# EAGLE design elm6 (EAGLE 4.16)

## Sheet 1 of 4
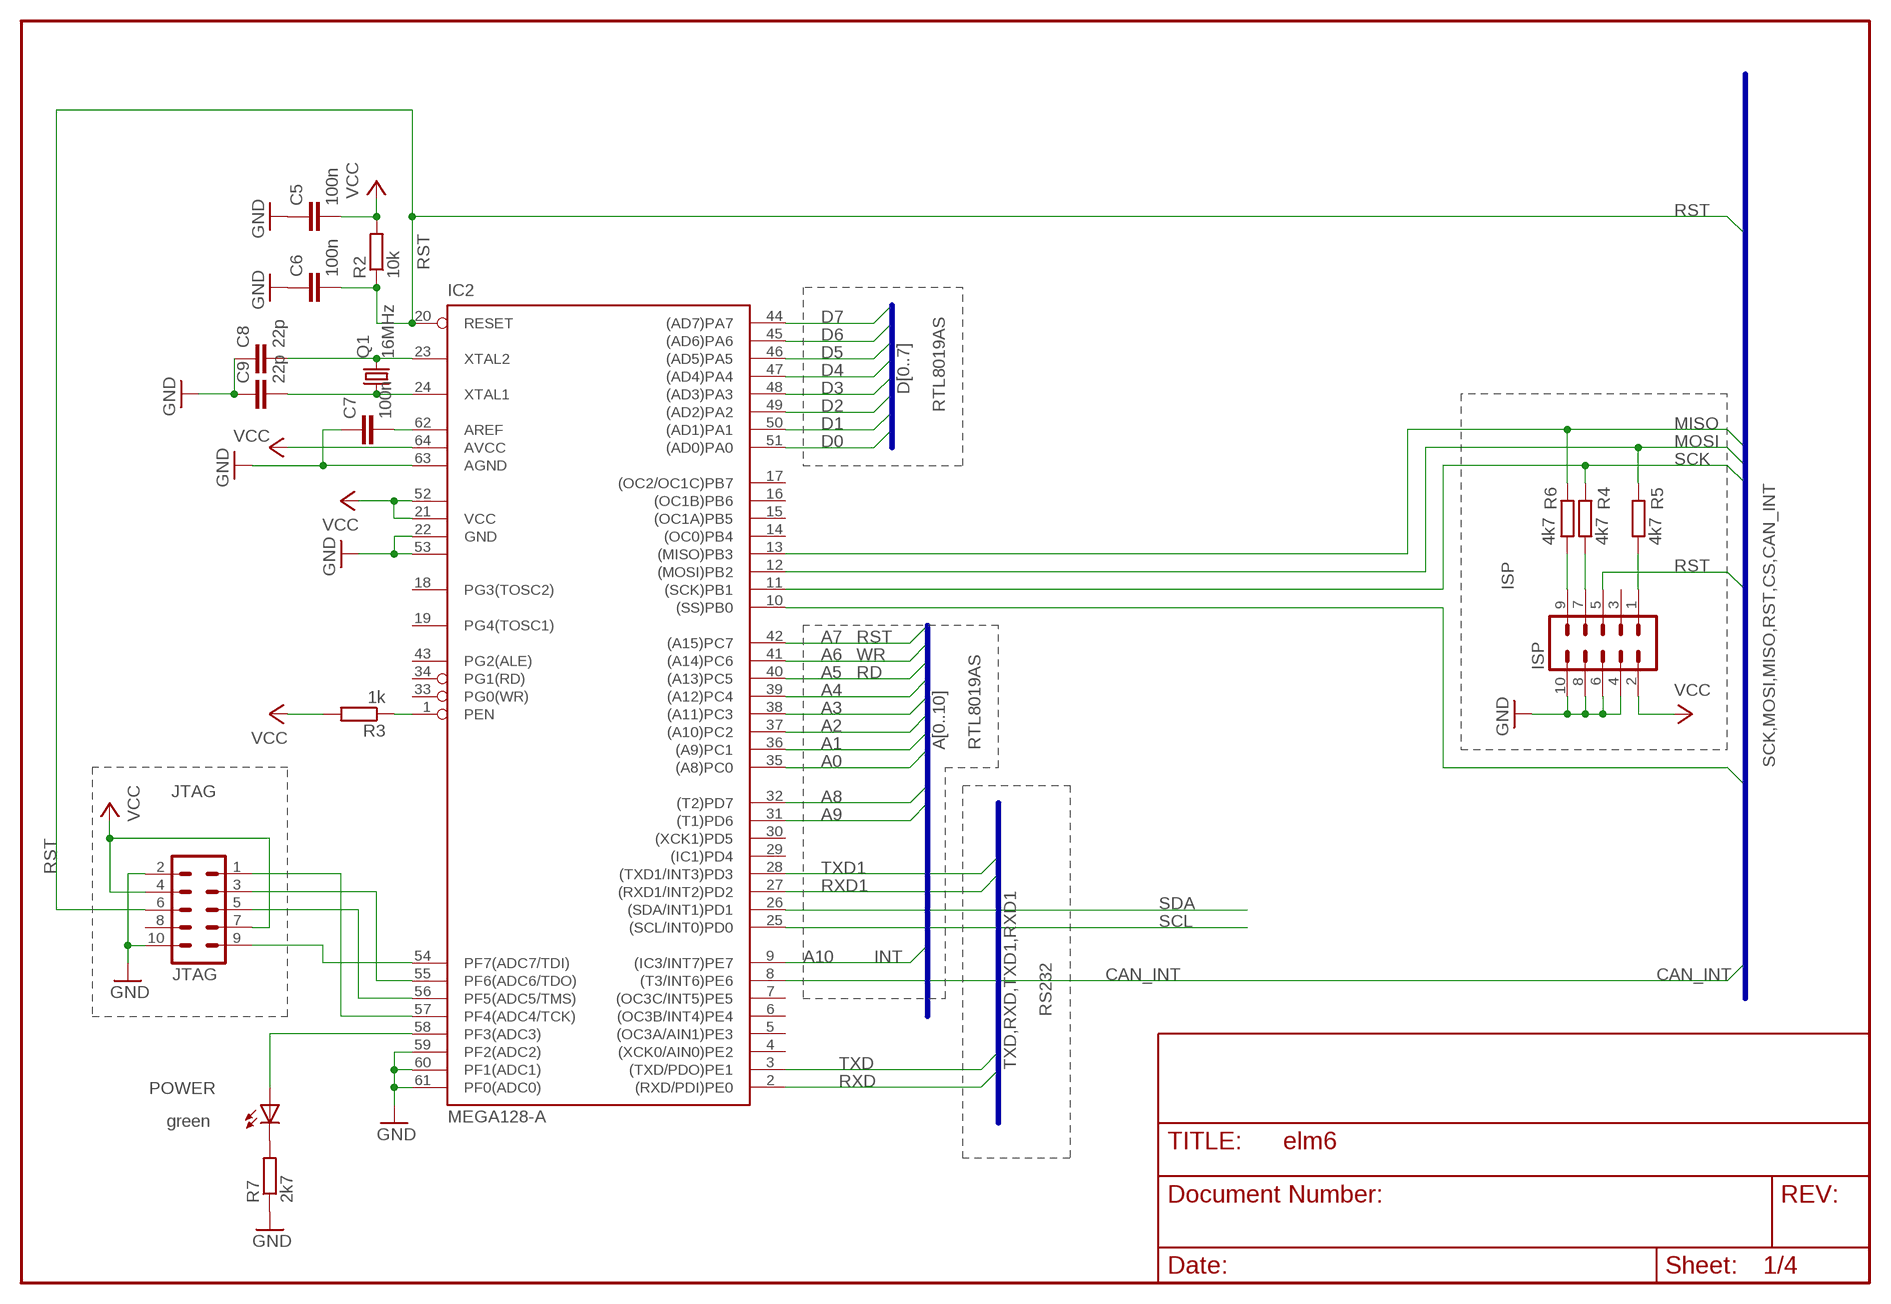
[diagram p0: schematic, sheet 1]

### Parts
C5  100n  C-EUC0603  [C0603]
C6  100n  C-EUC0603  [C0603]
C7  100n  C-EUC0603  [C0603]
C8  22p  C-EUC0603  [C0603]
C9  22p  C-EUC0603  [C0603]
IC2  MEGA128-A  [TQFP64]
ISP  MA05-2  [MA05-2]
JTAG  MA05-2  [MA05-2]
POWER  green  LED3MM  [LED3MM]
Q1  16MHz  CRYSTALHC49U-V  [HC49U-V]
R2  10k  R-EU_R0805  [R0805]
R3  1k  R-EU_R0805  [R0805]
R4  4k7  R-EU_R0805  [R0805]
R5  4k7  R-EU_R0805  [R0805]
R6  4k7  R-EU_R0805  [R0805]
R7  2k7  R-EU_R0805  [R0805]

### Nets
A0: IC2.35((A8)PC0) ; also sheet 3
A1: IC2.36((A9)PC1) ; also sheet 3
A2: IC2.37((A10)PC2) ; also sheet 3
A3: IC2.38((A11)PC3) ; also sheet 3
A4: IC2.39((A12)PC4) ; also sheet 3
A5: IC2.40((A13)PC5) ; also sheet 3
A6: IC2.41((A14)PC6) ; also sheet 3
A7: IC2.42((A15)PC7) ; also sheet 3
A8: IC2.32((T2)PD7) ; also sheet 3
A9: IC2.31((T1)PD6) ; also sheet 3
A10: IC2.9((IC3/INT7)PE7) ; also sheet 3
CAN_INT: IC2.8((T3/INT6)PE6) ; also sheet 2
CS: IC2.10((SS)PB0) ; also sheet 2
D0: IC2.51((AD0)PA0) ; also sheet 3
D1: IC2.50((AD1)PA1) ; also sheet 3
D2: IC2.49((AD2)PA2) ; also sheet 3
D3: IC2.48((AD3)PA3) ; also sheet 3
D4: IC2.47((AD4)PA4) ; also sheet 3
D5: IC2.46((AD5)PA5) ; also sheet 3
D6: IC2.45((AD6)PA6) ; also sheet 3
D7: IC2.44((AD7)PA7) ; also sheet 3
GND: C5.1 C6.1 C7.1 C8.1 C9.1 IC2.22(GND) IC2.53(GND1) IC2.59(PF2(ADC2)) IC2.60(PF1(ADC1)) IC2.61(PF0(ADC0)) IC2.63(AGND) ISP.4 ISP.6 ISP.8 ISP.10 JTAG.2 JTAG.10 R7.1 ; also sheet 2,3,4
MISO: IC2.13((MISO)PB3) R6.2 ; also sheet 2
MOSI: IC2.12((MOSI)PB2) R5.2 ; also sheet 2
N$5: C7.2 IC2.62(AREF)
N$6: C9.2 IC2.24(XTAL1) Q1.1
N$7: C8.2 IC2.23(XTAL2) Q1.2
N$22: ISP.9 R6.1
N$25: ISP.1 R5.1
N$26: IC2.1(PEN) R3.1
N$29: ISP.7 R4.1
N$31: POWER.K(C) R7.2
N$32: IC2.58(PF3(ADC3)) POWER.A
N$68: IC2.54(PF7(ADC7/TDI)) JTAG.9
N$69: IC2.55(PF6(ADC6/TDO)) JTAG.3
N$70: IC2.56(PF5(ADC5/TMS)) JTAG.5
N$71: IC2.57(PF4(ADC4/TCK)) JTAG.1
RST: C6.2 IC2.20(RESET) ISP.5 JTAG.6 R2.1 ; also sheet 2,4
RXD: IC2.2((RXD/PDI)PE0) ; also sheet 4
RXD1: IC2.27((RXD1/INT2)PD2) ; also sheet 4
SCK: IC2.11((SCK)PB1) R4.2 ; also sheet 2
SCL: IC2.25((SCL/INT0)PD0) ; also sheet 4
SDA: IC2.26((SDA/INT1)PD1) ; also sheet 4
TXD: IC2.3((TXD/PDO)PE1) ; also sheet 4
TXD1: IC2.28((TXD1/INT3)PD3) ; also sheet 4
VCC: C5.2 IC2.21(VCC) IC2.52(VCC1) IC2.64(AVCC) ISP.2 JTAG.4 JTAG.7 R2.2 R3.2 ; also sheet 2,3,4
Unconnected: IC2.4((XCK0/AIN0)PE2) IC2.5((OC3A/AIN1)PE3) IC2.6((OC3B/INT4)PE4) IC2.7((OC3C/INT5)PE5) IC2.14((OC0)PB4) IC2.15((OC1A)PB5) IC2.16((OC1B)PB6) IC2.17((OC2/OC1C)PB7) IC2.18(PG3(TOSC2)) IC2.19(PG4(TOSC1)) IC2.29((IC1)PD4) IC2.30((XCK1)PD5) IC2.33(PG0(WR)) IC2.34(PG1(RD)) IC2.43(PG2(ALE)) ISP.3 JTAG.8

### Buses
SCK,MOSI,MISO,RST,CS,CAN_INT
TXD,RXD,TXD1,RXD1
D[0..7]
A[0..10]

### Notes on the sheet
- RTL8019AS
- ISP
- RST
- WR
- RD
- RTL8019AS
- JTAG
- INT
- RS232

## Sheet 2 of 4
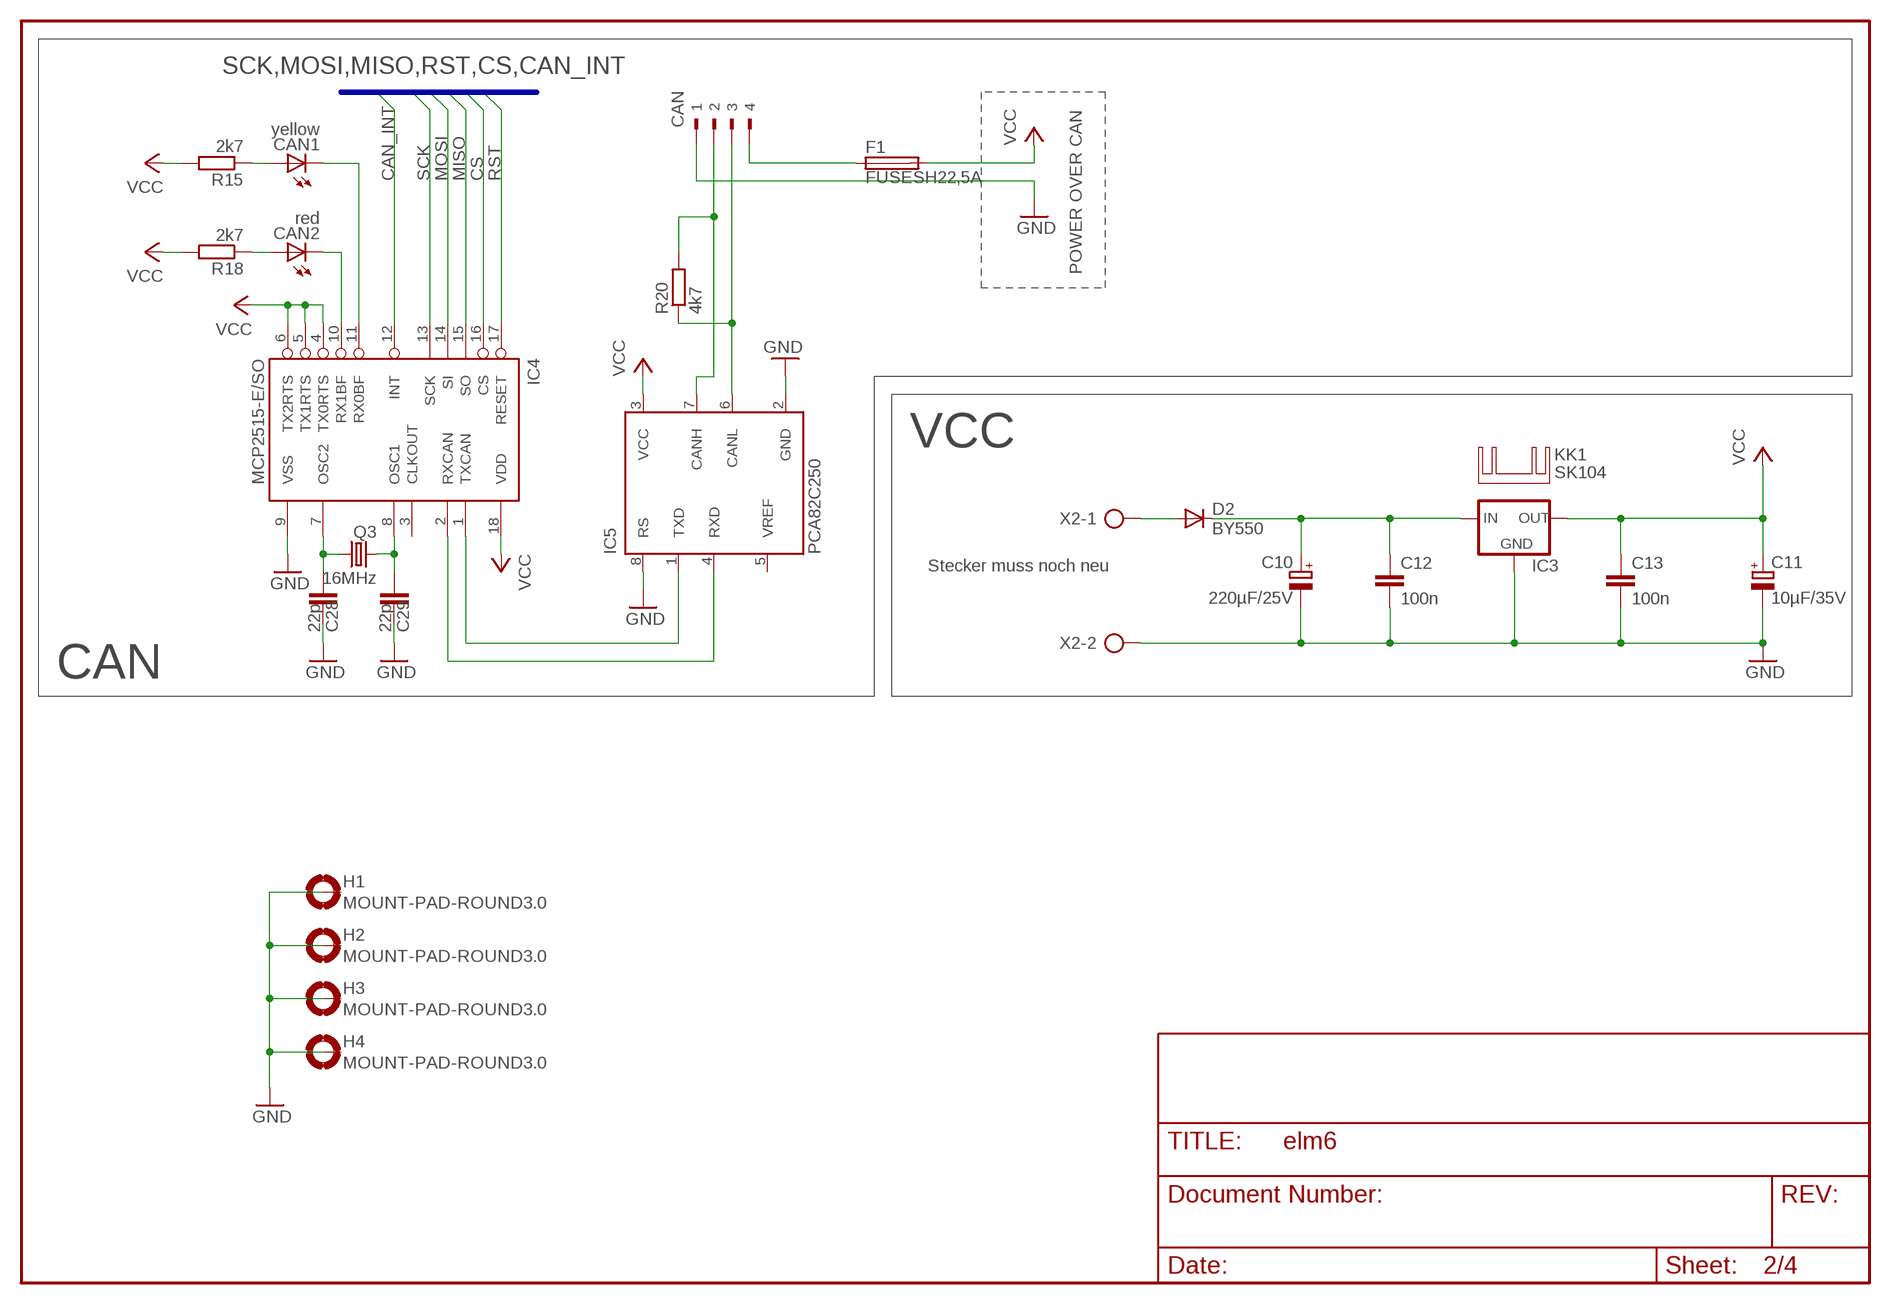
[diagram p1: schematic, sheet 2]

### Parts
C10  220µF/25V  CPOL-EUE3.5-8  [E3,5-8]
C11  10µF/35V  CPOL-EUE2-5  [E2-5]
C12  100n  C-EUC0603  [C0603]
C13  100n  C-EUC0603  [C0603]
C28  22p  C-EUC0603  [C0603]
C29  22p  C-EUC0603  [C0603]
CAN  90-4  [90-4]
CAN1  yellow  LED3MM  [LED3MM]
CAN2  red  LED3MM  [LED3MM]
D2  BY550  [DO27-15]
F1  FUSESH22,5A  [SH22,5A]
H1  MOUNT-PAD-ROUND3.0  [3,0-PAD]
H2  MOUNT-PAD-ROUND3.0  [3,0-PAD]
H3  MOUNT-PAD-ROUND3.0  [3,0-PAD]
H4  MOUNT-PAD-ROUND3.0  [3,0-PAD]
IC3  78XXS  [78XXS]
IC4  MCP2515-E/SO  [SO18L]
IC5  PCA82C250  [DIL08]
KK1  SK104  [SK104]
Q3  16MHz  CRYSTALHC49U-V  [HC49U-V]
R15  2k7  R-EU_R0805  [R0805]
R18  2k7  R-EU_R0805  [R0805]
R20  4k7  R-EU_R0805  [R0805]
X2  AK500/2-H  [AK500/2-H]

### Nets
CAN_INT: IC4.12(INT) ; also sheet 1
CS: IC4.16(CS) ; also sheet 1
GND: C10.- C11.- C12.2 C13.2 C28.2 C29.2 CAN.1 H1.B3,0(MOUNT) H2.B3,0(MOUNT) H3.B3,0(MOUNT) H4.B3,0(MOUNT) IC3.GND IC4.9(VSS) IC5.2(GND) IC5.8(RS) X2.2 ; also sheet 1,3,4
MISO: IC4.15(SO) ; also sheet 1
MOSI: IC4.14(SI) ; also sheet 1
N$2: IC4.1(TXCAN) IC5.1(TXD)
N$8: C10.+ C12.1 D2.C IC3.IN
N$10: D2.A X2.1
N$16: CAN.4 F1.1
N$21: IC4.2(RXCAN) IC5.4(RXD)
N$23: CAN.3 IC5.6(CANL) R20.1
N$27: CAN1.K(C) IC4.11(RX0BF)
N$38: CAN2.K(C) IC4.10(RX1BF)
N$48: CAN1.A R15.1
N$52: CAN2.A R18.1
N$53: C28.1 IC4.7(OSC2) Q3.1
N$54: C29.1 IC4.8(OSC1) Q3.2
N$59: CAN.2 IC5.7(CANH) R20.2
RST: IC4.17(RESET) ; also sheet 1,4
SCK: IC4.13(SCK) ; also sheet 1
VCC: C11.+ C13.1 F1.2 IC3.OUT IC4.4(TX0RTS) IC4.5(TX1RTS) IC4.6(TX2RTS) IC4.18(VDD) IC5.3(VCC) R15.2 R18.2 ; also sheet 1,3,4
Unconnected: IC4.3(CLKOUT) IC5.5(VREF)

### Buses
SCK,MOSI,MISO,RST,CS,CAN_INT

### Notes on the sheet
- POWER OVER CAN
- VCC
- Stecker muss noch neu
- CAN

## Sheet 3 of 4
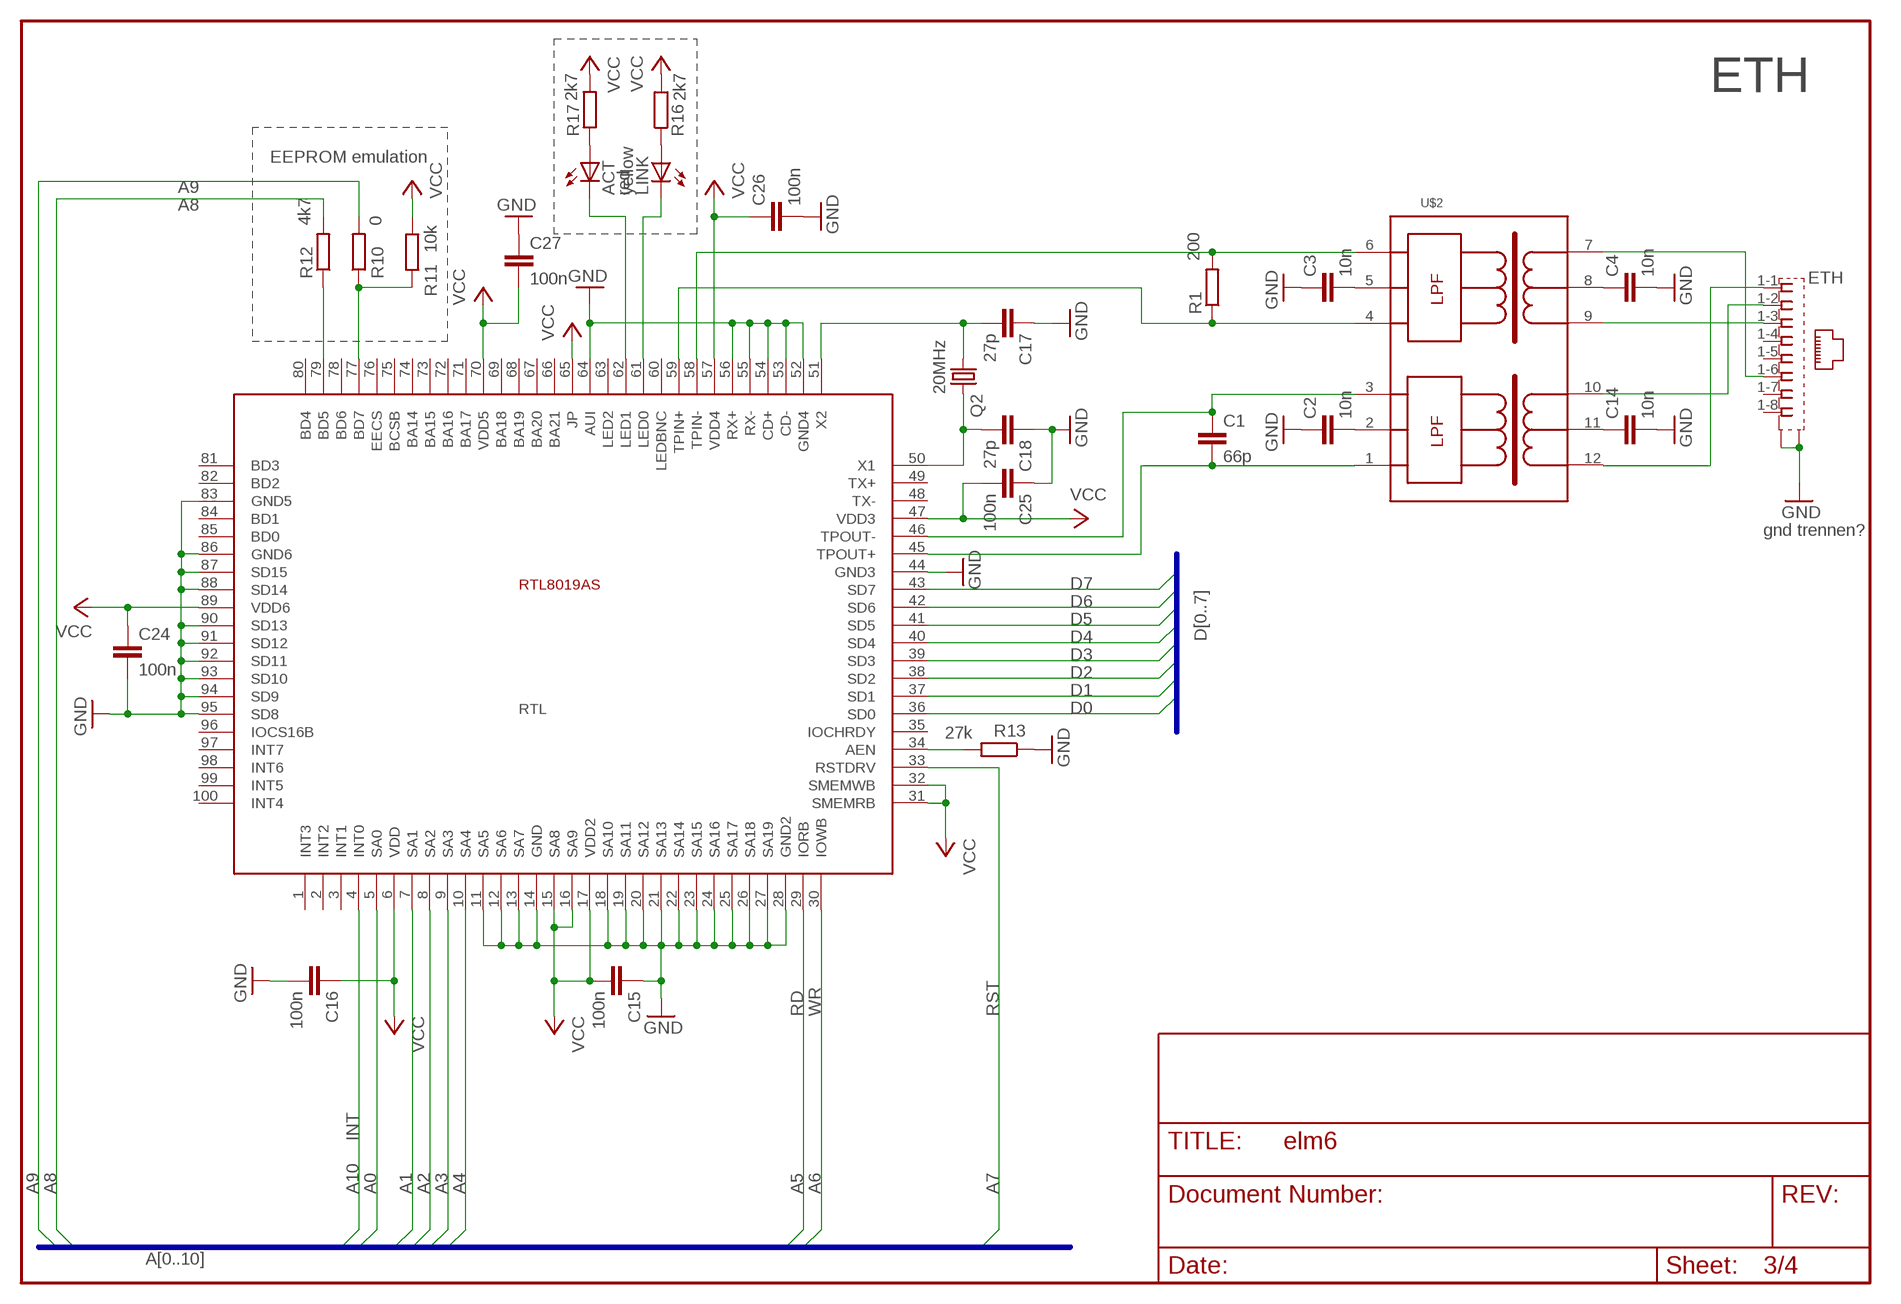
[diagram p2: schematic, sheet 3]

### Parts
ACT  red  LED3MM  [LED3MM]
C1  66p  C-EUC0603  [C0603]
C2  10n  C-EUC0603  [C0603]
C3  10n  C-EUC0603  [C0603]
C4  10n  C-EUC0603  [C0603]
C14  10n  C-EUC0603  [C0603]
C15  100n  C-EUC0603  [C0603]
C16  100n  C-EUC0603  [C0603]
C17  27p  C-EUC0603  [C0603]
C18  27p  C-EUC0603  [C0603]
C24  100n  C-EUC0603  [C0603]
C25  100n  C-EUC0603  [C0603]
C26  100n  C-EUC0603  [C0603]
C27  100n  C-EUC0603  [C0603]
ETH  557786-1  [557786-1]
LINK  yellow  LED3MM  [LED3MM]
Q2  20MHz  CRYSTALHC49U-V  [HC49U-V]
R1  200  R-EU_R0805  [R0805]
R10  0  R-EU_R0805  [R0805]
R11  10k  R-EU_R0805  [R0805]
R12  4k7  R-EU_R0805  [R0805]
R13  27k  R-EU_R0805  [R0805]
R16  2k7  R-EU_R0805  [R0805]
R17  2k7  R-EU_R0805  [R0805]
RTL  RTL8019AS  [RTL8019AS]
U$2  20F001  [DIL16/12]

### Nets
A0: RTL.5(SA0) ; also sheet 1
A1: RTL.7(SA1) ; also sheet 1
A2: RTL.8(SA2) ; also sheet 1
A3: RTL.9(SA3) ; also sheet 1
A4: RTL.10(SA4) ; also sheet 1
A5: RTL.29(IORB) ; also sheet 1
A6: RTL.30(IOWB) ; also sheet 1
A7: RTL.33(RSTDRV) ; also sheet 1
A8: R12.2 ; also sheet 1
A9: R10.2 ; also sheet 1
A10: RTL.4(INT0) ; also sheet 1
D0: RTL.36(SD0) ; also sheet 1
D1: RTL.37(SD1) ; also sheet 1
D2: RTL.38(SD2) ; also sheet 1
D3: RTL.39(SD3) ; also sheet 1
D4: RTL.40(SD4) ; also sheet 1
D5: RTL.41(SD5) ; also sheet 1
D6: RTL.42(SD6) ; also sheet 1
D7: RTL.43(SD7) ; also sheet 1
GND: C2.1 C3.1 C4.2 C14.2 C15.1 C16.2 C17.1 C18.1 C24.2 C25.1 C26.2 C27.1 ETH.G1(S2) ETH.G2(S1) R13.1 RTL.11(SA5) RTL.12(SA6) RTL.13(SA7) RTL.14(GND) RTL.18(SA10) RTL.19(SA11) RTL.20(SA12) RTL.21(SA13) RTL.22(SA14) RTL.23(SA15) RTL.24(SA16) RTL.25(SA17) RTL.26(SA18) RTL.27(SA19) RTL.28(GND2) RTL.44(GND3) RTL.52(GND4) RTL.53(CD-) RTL.54(CD+) RTL.55(RX-) RTL.56(RX+) RTL.64(AUI) RTL.83(GND5) RTL.86(GND6) RTL.87(SD15) RTL.88(SD14) RTL.90(SD13) RTL.91(SD12) RTL.92(SD11) RTL.93(SD10) RTL.94(SD9) RTL.95(SD8) ; also sheet 1,2,4
N$1: R1.2 RTL.58(TPIN-) U$2.6
N$3: R1.1 RTL.59(TPIN+) U$2.4
N$4: C1.1 RTL.46(TPOUT-) U$2.3
N$11: C1.2 RTL.45(TPOUT+) U$2.1
N$12: C3.2 U$2.5
N$13: C2.2 U$2.2
N$14: C14.1 U$2.11
N$15: C4.1 U$2.8
N$18: ETH.1-1 U$2.12
N$19: ETH.1-2 U$2.10
N$20: ETH.1-3 U$2.9
N$24: ETH.1-6 U$2.7
N$28: LINK.A R16.1
N$34: C17.2 Q2.2 RTL.51(X2)
N$35: C18.2 Q2.1 RTL.50(X1)
N$36: R10.1 R11.2 RTL.77(BD7)
N$37: R12.1 RTL.79(BD5)
N$39: R13.2 RTL.34(AEN)
N$44: ACT.A R17.1
N$45: LINK.K(C) RTL.61(LED0)
N$47: ACT.K(C) RTL.62(LED1)
VCC: C15.2 C16.1 C24.1 C25.2 C26.1 C27.2 R11.1 R16.2 R17.2 RTL.6(VDD) RTL.15(SA8) RTL.16(SA9) RTL.17(VDD2) RTL.31(SMEMRB) RTL.32(SMEMWB) RTL.47(VDD3) RTL.57(VDD4) RTL.65(JP) RTL.70(VDD5) RTL.89(VDD6) ; also sheet 1,2,4
Unconnected: ETH.1-4 ETH.1-5 ETH.1-7 ETH.1-8 RTL.1(INT3) RTL.2(INT2) RTL.3(INT1) RTL.35(IOCHRDY) RTL.48(TX-) RTL.49(TX+) RTL.60(LEDBNC) RTL.63(LED2) RTL.66(BA21) RTL.67(BA20) RTL.68(BA19) RTL.69(BA18) RTL.71(BA17) RTL.72(BA16) RTL.73(BA15) RTL.74(BA14) RTL.75(BCSB) RTL.76(EECS) RTL.78(BD6) RTL.80(BD4) RTL.81(BD3) RTL.82(BD2) RTL.84(BD1) RTL.85(BD0) RTL.96(IOCS16B) RTL.97(INT7) RTL.98(INT6) RTL.99(INT5) RTL.100(INT4)

### Buses
D[0..7]
A[0..10]

### Notes on the sheet
- ETH
- EEPROM emulation
- gnd trennen?
- RD | WR | RST
- INT

## Sheet 4 of 4
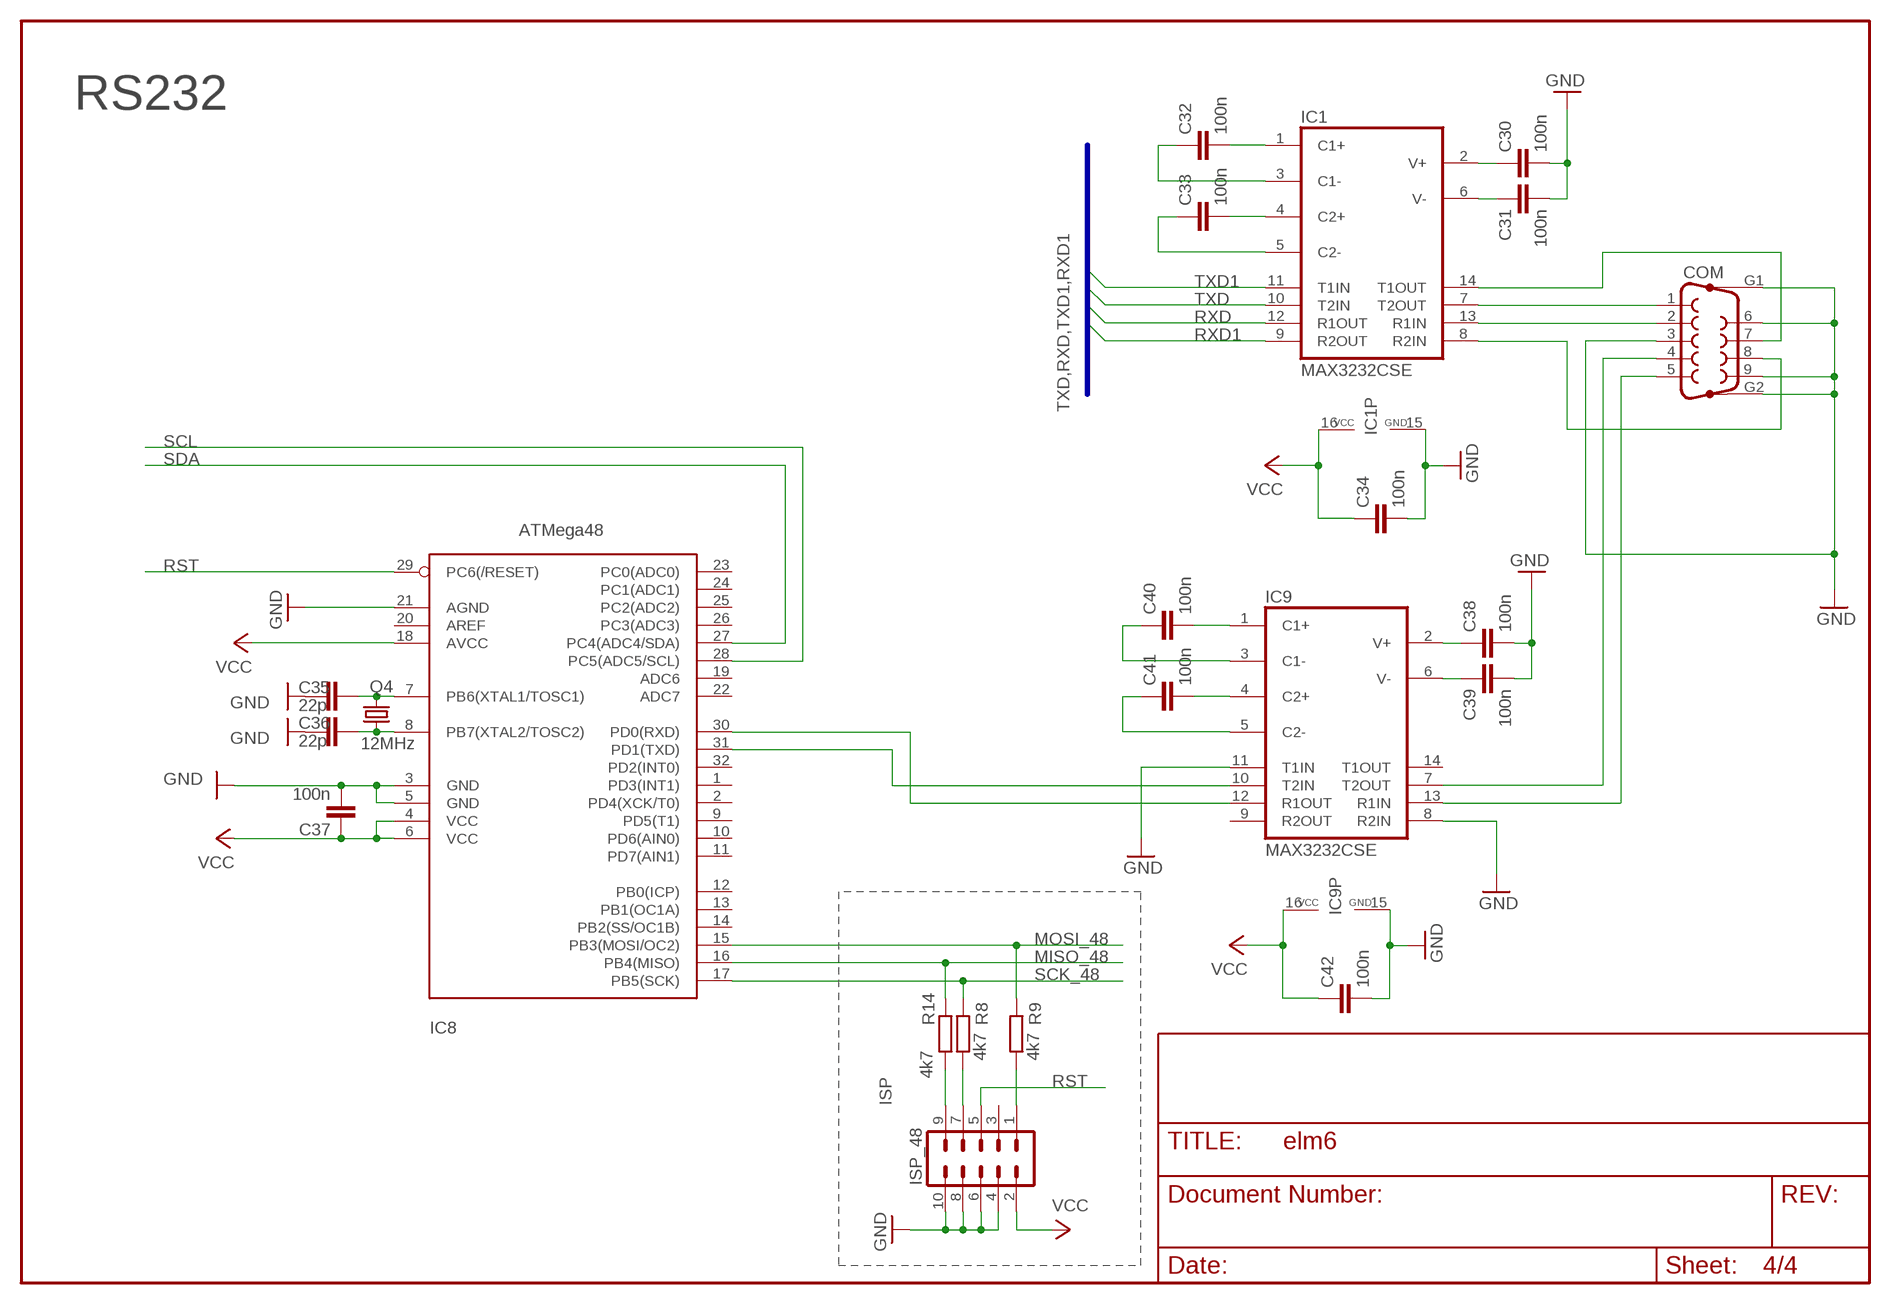
[diagram p3: schematic, sheet 4]

### Parts
C30  100n  C-EUC0603  [C0603]
C31  100n  C-EUC0603  [C0603]
C32  100n  C-EUC0603  [C0603]
C33  100n  C-EUC0603  [C0603]
C34  100n  C-EUC0603  [C0603]
C35  22p  C-EUC0603  [C0603]
C36  22p  C-EUC0603  [C0603]
C37  100n  C-EUC0603  [C0603]
C38  100n  C-EUC0603  [C0603]
C39  100n  C-EUC0603  [C0603]
C40  100n  C-EUC0603  [C0603]
C41  100n  C-EUC0603  [C0603]
C42  100n  C-EUC0603  [C0603]
COM  F09HP  [F09HP]
IC1  MAX3232CSE  [SO16]
IC8  ATMega48  MEGA8-AI  [TQFP32-08]
IC9  MAX3232CSE  [SO16]
ISP_48  MA05-2  [MA05-2]
Q4  12MHz  CRYTALHC49S  [HC49/S]
R8  4k7  R-EU_R0805  [R0805]
R9  4k7  R-EU_R0805  [R0805]
R14  4k7  R-EU_R0805  [R0805]

### Nets
GND: C30.2 C31.2 C34.2 C35.1 C36.2 C37.2 C38.2 C39.2 C42.2 COM.3 COM.6 COM.9 COM.G1 COM.G2 IC1.15(GND) IC8.3(GND) IC8.5(GND) IC8.21(AGND) IC9.8(R2IN) IC9.11(T1IN) IC9.15(GND) ISP_48.4 ISP_48.6 ISP_48.8 ISP_48.10 ; also sheet 1,2,3
MISO_48: IC8.16(PB4(MISO)) R14.2
MOSI_48: IC8.15(PB3(MOSI/OC2)) R9.2
N$9: COM.1 IC1.7(T2OUT)
N$17: ISP_48.9 R14.1
N$30: ISP_48.1 R9.1
N$33: COM.2 IC1.13(R1IN)
N$40: ISP_48.7 R8.1
N$60: C32.2 IC1.1(C1+)
N$61: C33.2 IC1.4(C2+)
N$72: C33.1 IC1.5(C2-)
N$73: C32.1 IC1.3(C1-)
N$74: COM.7 IC1.14(T1OUT)
N$75: COM.8 IC1.8(R2IN)
N$76: C30.1 IC1.2(V+)
N$77: C31.1 IC1.6(V-)
N$78: COM.4 IC9.7(T2OUT)
N$79: C35.2 IC8.7(PB6(XTAL1/TOSC1)) Q4.2
N$80: C36.1 IC8.8(PB7(XTAL2/TOSC2)) Q4.1
N$82: COM.5 IC9.13(R1IN)
N$83: C40.2 IC9.1(C1+)
N$84: C41.2 IC9.4(C2+)
N$85: C41.1 IC9.5(C2-)
N$86: C40.1 IC9.3(C1-)
N$87: IC8.30(PD0(RXD)) IC9.12(R1OUT)
N$88: IC8.31(PD1(TXD)) IC9.10(T2IN)
N$89: C38.1 IC9.2(V+)
N$90: C39.1 IC9.6(V-)
RST: IC8.29(PC6(/RESET)) ISP_48.5 ; also sheet 1,2
RXD: IC1.12(R1OUT) ; also sheet 1
RXD1: IC1.9(R2OUT) ; also sheet 1
SCK_48: IC8.17(PB5(SCK)) R8.2
SCL: IC8.28(PC5(ADC5/SCL)) ; also sheet 1
SDA: IC8.27(PC4(ADC4/SDA)) ; also sheet 1
TXD: IC1.10(T2IN) ; also sheet 1
TXD1: IC1.11(T1IN) ; also sheet 1
VCC: C34.1 C37.1 C42.1 IC1.16(VCC) IC8.4(VCC) IC8.6(VCC) IC8.18(AVCC) IC9.16(VCC) ISP_48.2 ; also sheet 1,2,3
Unconnected: IC8.1(PD3(INT1)) IC8.2(PD4(XCK/T0)) IC8.9(PD5(T1)) IC8.10(PD6(AIN0)) IC8.11(PD7(AIN1)) IC8.12(PB0(ICP)) IC8.13(PB1(OC1A)) IC8.14(PB2(SS/OC1B)) IC8.19(ADC6) IC8.20(AREF) IC8.22(ADC7) IC8.23(PC0(ADC0)) IC8.24(PC1(ADC1)) IC8.25(PC2(ADC2)) IC8.26(PC3(ADC3)) IC8.32(PD2(INT0)) IC9.9(R2OUT) IC9.14(T1OUT) ISP_48.3

### Buses
TXD,RXD,TXD1,RXD1

### Notes on the sheet
- RS232
- ISP

## Library data of the parts
ACT CAN1 CAN2 LINK POWER = led:LED: LED OSRAM: - CHIPLED LG R971, LG N971, LY N971, LG Q971, LY Q971, LO R971, LY R971 LH N974, LH R974 LS Q976, LO Q976, LY Q976 LO Q996 - Hyper CHIPLED LW Q18S LB Q993, LB Q99A, LB R99A - SideLED LS A670, LO A670, LY A670, LG A670, LP A670 LB A673, LV A673, LT A673, LW A673 LH A674 LY A675 LS A676, LA A676, LO A676, LY A676, LW A676 LS A679, LY A679, LG A679 - Hyper Micro SIDELED® LS Y876, LA Y876, LO Y876, LY Y876 LT Y87S - SmartLED LW L88C, LW L88S LB L89C, LB L89S, LG L890 LS L89K, LO L89K, LY L89K LS L896, LA L896, LO L896, LY L896 - TOPLED LS T670, LO T670, LY T670, LG T670, LP T670 LSG T670, LSP T670, LSY T670, LOP T670, LYG T670 LG T671, LOG T671, LSG T671 LB T673, LV T673, LT T673, LW T673 LH T674 LS T676, LA T676, LO T676, LY T676, LB T676, LH T676, LSB T676, LW T676 LB T67C, LV T67C, LT T67C, LS T67K, LO T67K, LY T67K, LW E67C LS E67B, LA E67B, LO E67B, LY E67B, LB E67C, LV E67C, LT E67C LW T67C LS T679, LY T679, LG T679 LS T770, LO T770, LY T770, LG T770, LP T770 LB T773, LV T773, LT T773, LW T773 LH T774 LS E675, LA E675, LY E675, LS T675 LS T776, LA T776, LO T776, LY T776, LB T776 LHGB T686 LT T68C, LB T68C - Hyper Mini TOPLED® LB M676 - Mini TOPLED Santana® LG M470 LS M47K, LO M47K, LY M47K Source: http://www.osram.convergy.de - LUMILED® LXK2-PW12-R00, LXK2-PW12-S00, LXK2-PW14-U00, LXK2-PW14-V00 LXK2-PM12-R00, LXK2-PM12-S00, LXK2-PM14-U00 LXK2-PE12-Q00, LXK2-PE12-R00, LXK2-PE12-S00, LXK2-PE14-T00, LXK2-PE14-U00 LXK2-PB12-K00, LXK2-PB12-L00, LXK2-PB12-M00, LXK2-PB14-N00, LXK2-PB14-P00, LXK2-PB14-Q00 LXK2-PR12-L00, LXK2-PR12-M00, LXK2-PR14-Q00, LXK2-PR14-R00 LXK2-PD12-Q00, LXK2-PD12-R00, LXK2-PD12-S00 LXK2-PH12-R00, LXK2-PH12-S00 LXK2-PL12-P00, LXK2-PL12-Q00, LXK2-PL12-R00 Source: www.luxeon.com
C1-C9 C12-C18 C24-C42 = rcl:C-EU: CAPACITOR, European symbol
C10 C11 = rcl:CPOL-EU: POLARIZED CAPACITOR, European symbol
CAN = con-weidmueller-sl35:90-4: WEIDMUELLER CLAMP CONNECTOR
COM = con-subd:F09HP: SUB-D
D2 = diode:BY550: DIODE Si200 V, 5 A
ETH = con-amp:557786-1: AMP connector
F1 = fuse:FUSE: Fuse
H1-H4 = holes:MOUNT-PAD-ROUND: MOUNTING PAD, round
IC1 IC9 = maxim:MAX3232*: True RS-232 Transceivers 3.0V to 5.5V, Low-Power up to 1Mbps, Using Four 0.1µF External Capacitors Source: http://pdfserv.maxim-ic.com/en/ds/MAX3222-MAX3241.pdf
IC2 = atmel:MEGA128: MICROCONTROLLER 128 Kbytes FLASH 4 Kbytes SRAM 4 Kbytes EEPROM DUAL USART 8-channel 10 bit ADC Source: avr.lbr
IC3 = v-reg:78XXS: VOLTAGE REGULATOR
IC4 = mcp2515:MCP2515
IC5 = micro-philips:PCA82C250: CAN CONTROLLER INTERFACE
IC8 = atmel:MEGA8: MICROCONTROLLER 8 Kbytes FLASH 1 kbytes SRAM 512 bytes EEPROM USART 6-channel 10 bit ADC 2-channel 8 bit ADC Source: avr.lbr
ISP ISP_48 JTAG = con-lstb:MA05-2: PIN HEADER
KK1 = heatsink:SK104: HEATSINK manufacturer Fischer/distributor Buerklin
Q1-Q3 = crystal:CRYSTAL: CRYSTAL
Q4 = crystal:CRYTAL: CRYSTAL
R1-R18 R20 = rcl:R-EU_: RESISTOR, European symbol
RTL = rtl8019as:RTL8019AS
U$2 = Realtek:20F001
X2 = con-ptr500:AK500/2-H: CONNECTOR Aug. 2004 / PTR Meßtechnik: Die Bezeichnung der Serie AK505 wurde geändert. Es handelt sich hierbei um AK500 in horizontaler Ausführung.

## Board
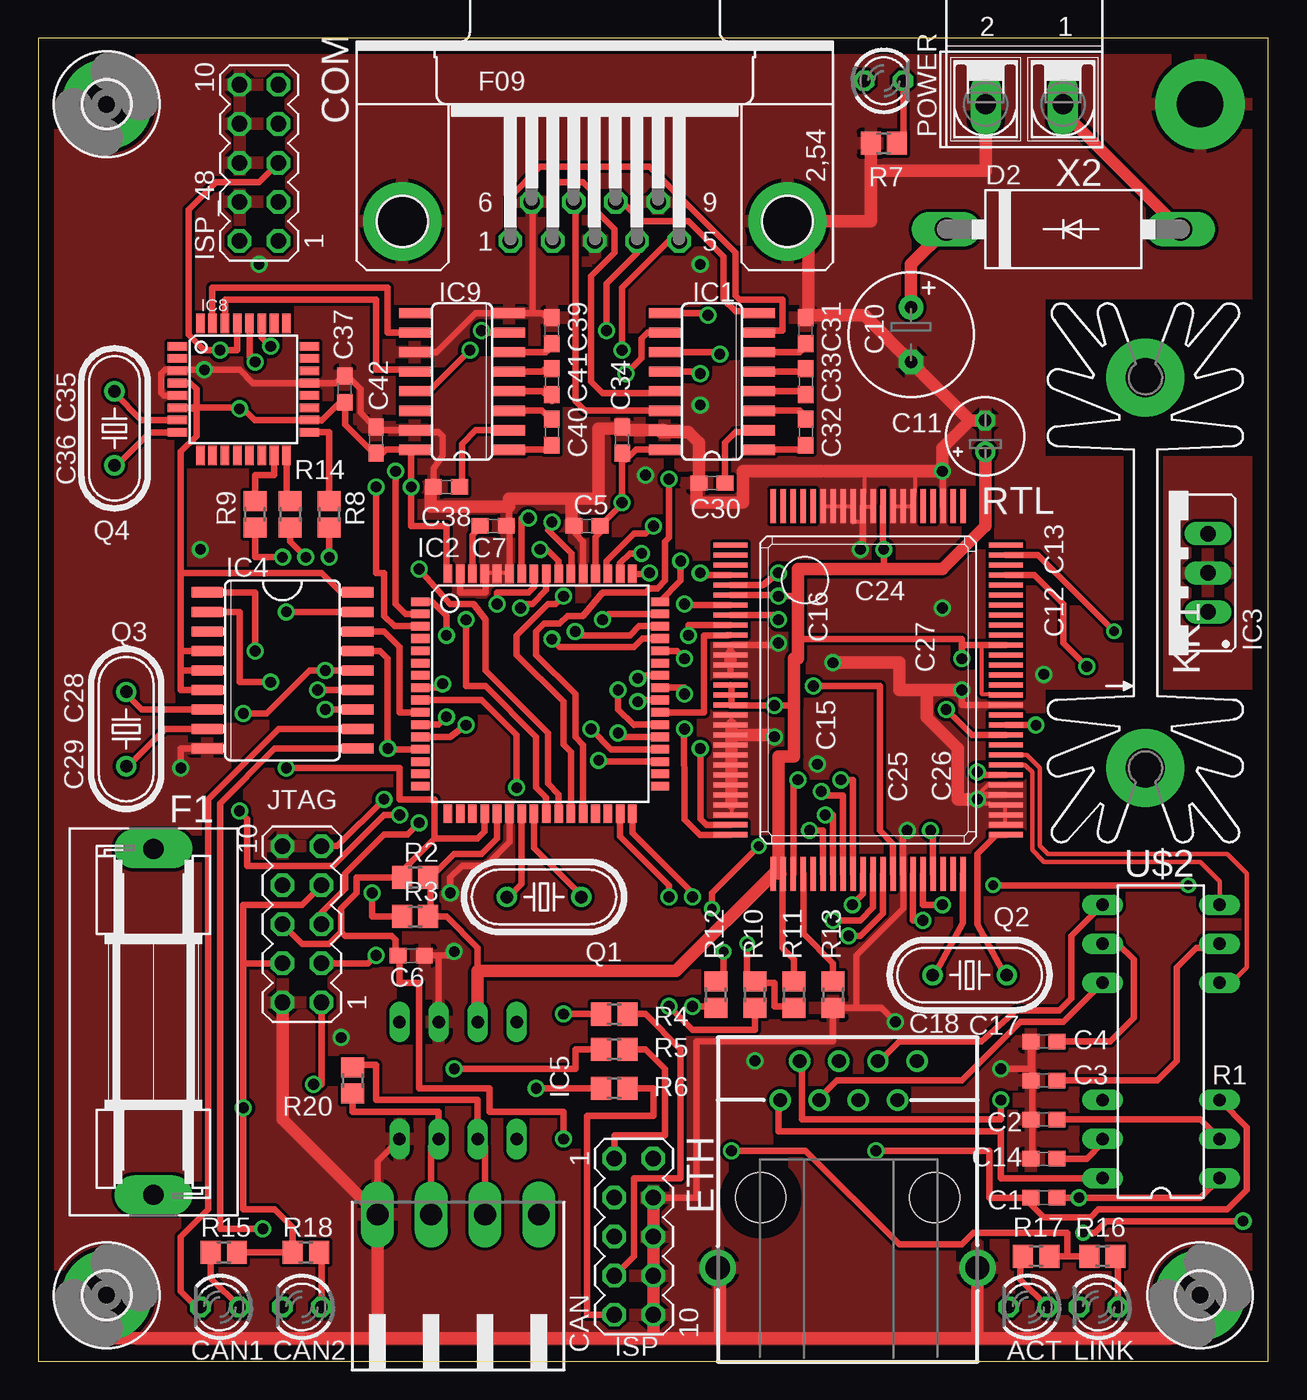
[diagram p4: board, top side]
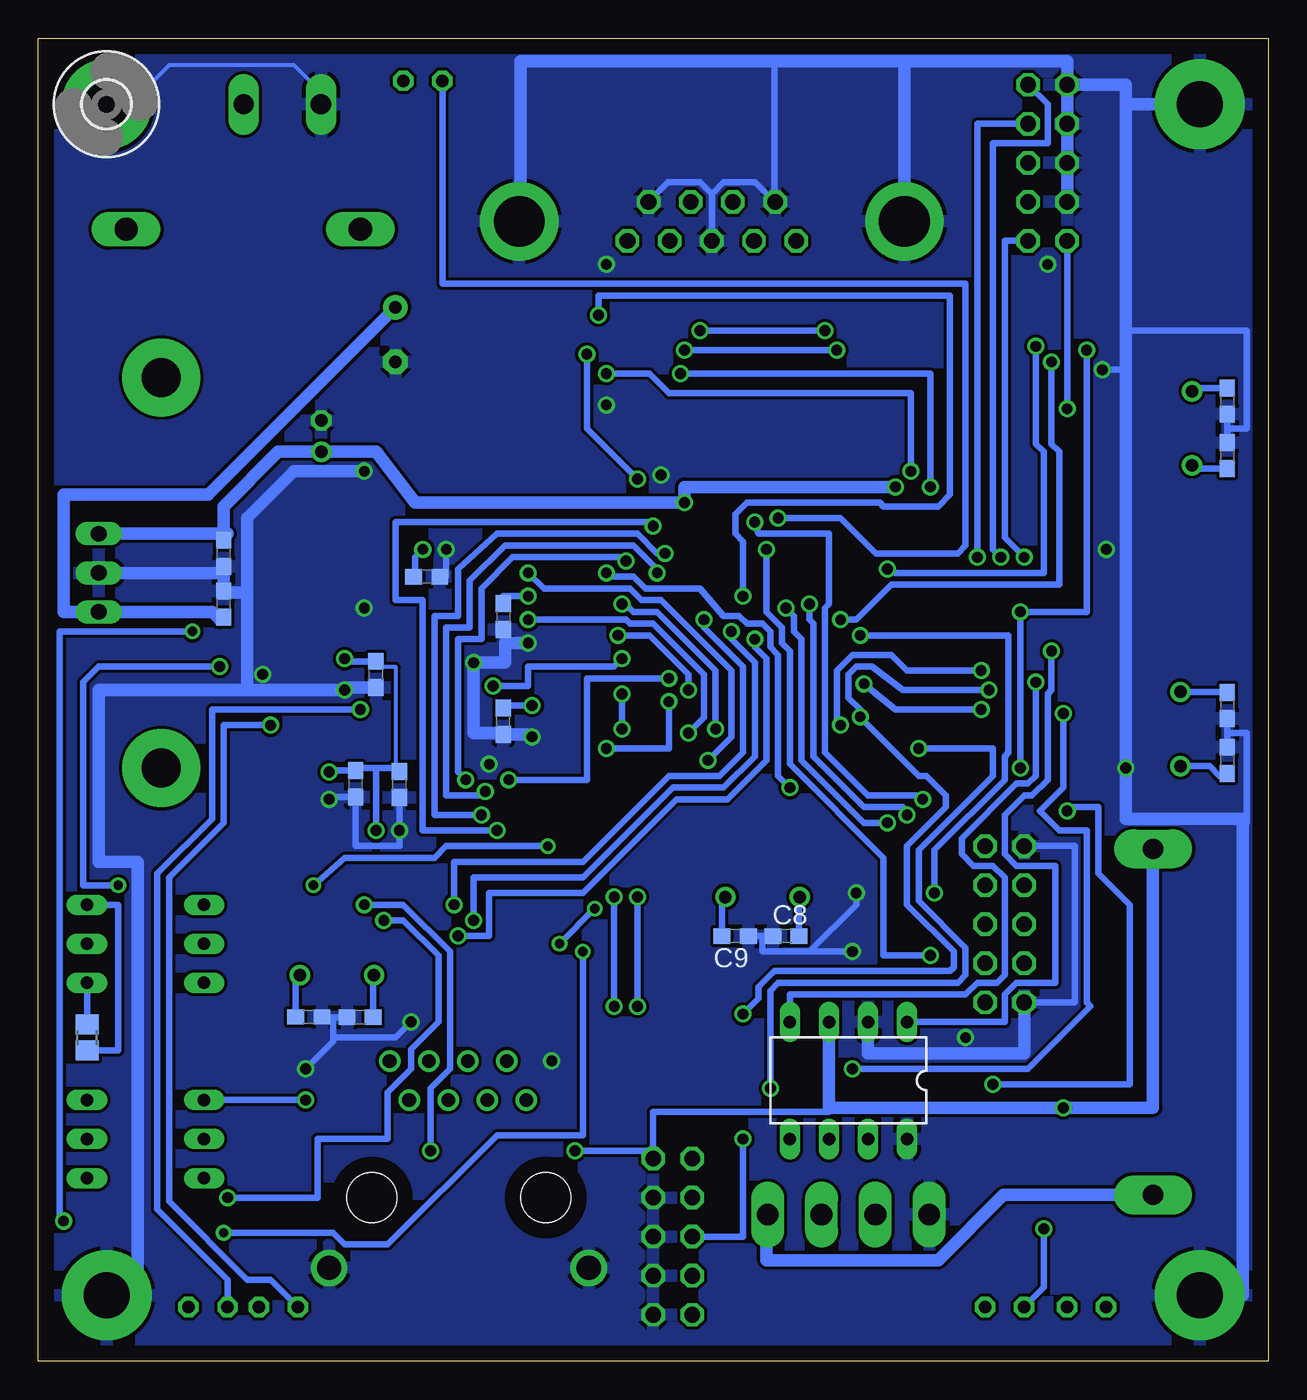
[diagram p5: board, bottom side, seen from below]

Size 79.99 x 86.03 mm. Coordinates in mm from the lower left corner, seen from the top.
Outline: 0,0 79.99,0 79.99,86.03 0,86.03 0,0
Copper layers (1*16): Top 0.035mm / dielectric 1.5mm / Bottom 0.035mm
Design rules "olimex_8mils": minimum track width 10mil, minimum drill 24mil, track to track 8mil, track to pad 8mil, pad to pad 8mil, via to via 8mil, smd to smd 8mil, copper to edge 40mil, drill to drill 10mil, minimum pad ring 10mil, minimum via ring 8mil, stop-mask expansion 0mil, vias tented up to drill 0mil, thermal gap 10mil

### Footprints (pad centres in the part's own frame; a part is rotated, then mirrored left to right if it is on the bottom)
LED3MM = drill 0.813 octagon: A -1.27,0; K 1.27,0
C0603 = smd 1.1 x 1: 1 -0.85,0; 2 0.85,0
E3,5-8 = drill 0.813 pad 1.6 round: + -1.778,0 | drill 0.813 pad 1.6 octagon: - 1.778,0
E2-5 = drill 0.813 pad 1.27 round: + -1.016,0 | drill 0.813 pad 1.27 octagon: - 1.016,0
90-4 = drill 1.422 long: 1 -5.25,5.25; 2 -1.75,5.25; 3 1.75,5.25; 4 5.25,5.25
F09HP = drill 1.016 octagon: 1 -5.486,-1.27; 2 -2.743,-1.27; 3 0,-1.27; 4 2.743,-1.27; 5 5.486,-1.27; 6 -4.115,1.27; 7 -1.372,1.27; 8 1.372,1.27; 9 4.115,1.27 | drill 3.302 pad 5.08 round: G1 -12.522,0; G2 12.522,0
DO27-15 = drill 1.499 long: A 7.62,0; C -7.62,0
557786-1 = drill 0.889 round: 1-1 -4.445,6.35; 1-2 -3.175,8.89; 1-3 -1.905,6.35; 1-4 -0.635,8.89; 1-5 0.635,6.35; 1-6 1.905,8.89; 1-7 3.175,6.35; 1-8 4.445,8.89 | drill 1.575 pad 2.184 round: G1 -8.509,-4.572; G2 8.382,-4.572 | hole 3.251: -5.715,0; 5.588,0
SH22,5A = drill 1.321 pad 2.54 long: 1 -11.252,0; 2 11.252,0
3,0-PAD = drill 3 pad 5.842 round: B3,0 0,0
SO16 = smd 0.66 x 2.032: 1 -4.445,-3.073; 2 -3.175,-3.073; 3 -1.905,-3.073; 4 -0.635,-3.073; 5 0.635,-3.073; 6 1.905,-3.073; 7 3.175,-3.073; 8 4.445,-3.073; 9 4.445,3.073; 10 3.175,3.073; 11 1.905,3.073; 12 0.635,3.073; 13 -0.635,3.073; 14 -1.905,3.073; 15 -3.175,3.073; 16 -4.445,3.073
TQFP64 = smd 1.194 x 0.559: 1 -7.8,6; 2 -7.8,5.2; 3 -7.8,4.4; 4 -7.8,3.6; 5 -7.8,2.8; 6 -7.8,2; 7 -7.8,1.2; 8 -7.8,0.4; 9 -7.8,-0.4; 10 -7.8,-1.2; 11 -7.8,-2; 12 -7.8,-2.8; 13 -7.8,-3.6; 14 -7.8,-4.4; 15 -7.8,-5.2; 16 -7.8,-6; 33 7.8,-6; 34 7.8,-5.2; 35 7.8,-4.4; 36 7.8,-3.6; 37 7.8,-2.8; 38 7.8,-2; 39 7.8,-1.2; 40 7.8,-0.4; 41 7.8,0.4; 42 7.8,1.2; 43 7.8,2; 44 7.8,2.8; 45 7.8,3.6; 46 7.8,4.4; 47 7.8,5.2; 48 7.8,6 | smd 0.559 x 1.194: 17 -6,-7.8; 18 -5.2,-7.8; 19 -4.4,-7.8; 20 -3.6,-7.8; 21 -2.8,-7.8; 22 -2,-7.8; 23 -1.2,-7.8; 24 -0.4,-7.8; 25 0.4,-7.8; 26 1.2,-7.8; 27 2,-7.8; 28 2.8,-7.8; 29 3.6,-7.8; 30 4.4,-7.8; 31 5.2,-7.8; 32 6,-7.8; 49 6,7.8; 50 5.2,7.8; 51 4.4,7.8; 52 3.6,7.8; 53 2.8,7.8; 54 2,7.8; 55 1.2,7.8; 56 0.4,7.8; 57 -0.4,7.8; 58 -1.2,7.8; 59 -2,7.8; 60 -2.8,7.8; 61 -3.6,7.8; 62 -4.4,7.8; 63 -5.2,7.8; 64 -6,7.8
78XXS = drill 1.016 long: GND 0,-2.54; IN -2.54,-2.54; OUT 2.54,-2.54
SO18L = smd 0.66 x 2.032: 1 -5.08,-4.902; 2 -3.81,-4.902; 3 -2.54,-4.902; 4 -1.27,-4.902; 5 0,-4.902; 6 1.27,-4.902; 7 2.54,-4.902; 8 3.81,-4.902; 9 5.08,-4.902; 10 5.08,4.902; 11 3.81,4.902; 12 2.54,4.902; 13 1.27,4.902; 14 0,4.902; 15 -1.27,4.902; 16 -2.54,4.902; 17 -3.81,4.902; 18 -5.08,4.902
DIL08 = drill 0.813 long: 1 -3.81,-3.81; 2 -1.27,-3.81; 3 1.27,-3.81; 4 3.81,-3.81; 5 3.81,3.81; 6 1.27,3.81; 7 -1.27,3.81; 8 -3.81,3.81
TQFP32-08 = smd 1.27 x 0.559: 1 -4.293,2.8; 2 -4.293,2; 3 -4.293,1.2; 4 -4.293,0.4; 5 -4.293,-0.4; 6 -4.293,-1.2; 7 -4.293,-2; 8 -4.293,-2.8; 17 4.293,-2.8; 18 4.293,-2; 19 4.293,-1.2; 20 4.293,-0.4; 21 4.293,0.4; 22 4.293,1.2; 23 4.293,2; 24 4.293,2.8 | smd 0.559 x 1.27: 9 -2.8,-4.293; 10 -2,-4.293; 11 -1.2,-4.293; 12 -0.4,-4.293; 13 0.4,-4.293; 14 1.2,-4.293; 15 2,-4.293; 16 2.8,-4.293; 25 2.8,4.293; 26 2,4.293; 27 1.2,4.293; 28 0.4,4.293; 29 -0.4,4.293; 30 -1.2,4.293; 31 -2,4.293; 32 -2.8,4.293
MA05-2 = drill 1.016 octagon: 1 -5.08,-1.27; 2 -5.08,1.27; 3 -2.54,-1.27; 4 -2.54,1.27; 5 0,-1.27; 6 0,1.27; 7 2.54,-1.27; 8 2.54,1.27; 9 5.08,-1.27; 10 5.08,1.27
SK104 = drill 2.54 pad 5.08 round: A2,5 -12.7,-0.762; B2,5 12.7,-0.762
HC49U-V = drill 0.813 round: 1 -2.413,0; 2 2.413,0
HC49/S = drill 0.813 round: 1 -2.413,0; 2 2.413,0
R0805 = smd 1.3 x 1.5: 1 -0.85,0; 2 0.85,0
RTL8019AS = smd 0.35 x 2.2: 1 -9.425,-8.965; 2 -8.775,-8.965; 3 -8.125,-8.965; 4 -7.475,-8.965; 5 -6.825,-8.965; 6 -6.175,-8.965; 7 -5.525,-8.965; 8 -4.875,-8.965; 9 -4.225,-8.965; 10 -3.575,-8.965; 11 -2.925,-8.965; 12 -2.275,-8.965; 13 -1.625,-8.965; 14 -0.975,-8.965; 15 -0.325,-8.965; 16 0.325,-8.965; 17 0.975,-8.965; 18 1.625,-8.965; 19 2.275,-8.965; 20 2.925,-8.965; 21 3.575,-8.965; 22 4.225,-8.965; 23 4.875,-8.965; 24 5.525,-8.965; 25 6.175,-8.965; 26 6.825,-8.965; 27 7.475,-8.965; 28 8.125,-8.965; 29 8.775,-8.965; 30 9.425,-8.965; 51 9.425,8.965; 52 8.775,8.965; 53 8.125,8.965; 54 7.475,8.965; 55 6.825,8.965; 56 6.175,8.965; 57 5.525,8.965; 58 4.875,8.965; 59 4.225,8.965; 60 3.575,8.965; 61 2.925,8.965; 62 2.275,8.965; 63 1.625,8.965; 64 0.975,8.965; 65 0.325,8.965; 66 -0.325,8.965; 67 -0.975,8.965; 68 -1.625,8.965; 69 -2.275,8.965; 70 -2.925,8.965; 71 -3.575,8.965; 72 -4.225,8.965; 73 -4.875,8.965; 74 -5.525,8.965; 75 -6.175,8.965; 76 -6.825,8.965; 77 -7.475,8.965; 78 -8.125,8.965; 79 -8.775,8.965; 80 -9.425,8.965 | smd 2.2 x 0.35: 31 11.965,-6.175; 32 11.965,-5.525; 33 11.965,-4.875; 34 11.965,-4.225; 35 11.965,-3.575; 36 11.965,-2.925; 37 11.965,-2.275; 38 11.965,-1.625; 39 11.965,-0.975; 40 11.965,-0.325; 41 11.965,0.325; 42 11.965,0.975; 43 11.965,1.625; 44 11.965,2.275; 45 11.965,2.925; 46 11.965,3.575; 47 11.965,4.225; 48 11.965,4.875; 49 11.965,5.525; 50 11.965,6.175; 81 -11.965,6.175; 82 -11.965,5.525; 83 -11.965,4.875; 84 -11.965,4.225; 85 -11.965,3.575; 86 -11.965,2.925; 87 -11.965,2.275; 88 -11.965,1.625; 89 -11.965,0.975; 90 -11.965,0.325; 91 -11.965,-0.325; 92 -11.965,-0.975; 93 -11.965,-1.625; 94 -11.965,-2.275; 95 -11.965,-2.925; 96 -11.965,-3.575; 97 -11.965,-4.225; 98 -11.965,-4.875; 99 -11.965,-5.525; 100 -11.965,-6.175
DIL16/12 = drill 0.813 long: 1 -8.89,-3.81; 2 -6.35,-3.81; 3 -3.81,-3.81; 4 3.81,-3.81; 5 6.35,-3.81; 6 8.89,-3.81; 7 8.89,3.81; 8 6.35,3.81; 9 3.81,3.81; 10 -3.81,3.81; 11 -6.35,3.81; 12 -8.89,3.81
AK500/2-H = drill 1.321 long: 1 -2.515,0; 2 2.515,0

### Placement (x,y rotation side)
ACT  64.38,3.52 180 top
C1  65.4,10.63 0 top
C2  65.4,15.71 0 top
C3  65.4,18.25 0 top
C4  65.4,20.79 180 top
C5  35.68,54.32 0 top
C6  24.25,26.38 180 top
C7  29.59,54.32 180 top
C8  31.36,27.65 0 bottom
C9  34.67,27.65 180 bottom
C10  56.76,66.76 270 top
C11  61.59,60.16 90 top
C12  67.94,49.24 90 bottom
C13  67.94,52.54 270 bottom
C14  65.4,13.17 180 top
C15  49.75,41.62 90 bottom
C16  49.75,48.43 270 bottom
C17  62.4,22.39 180 bottom
C18  59.08,22.36 0 bottom
C24  54.73,51.02 0 bottom
C25  56.51,37.5 90 bottom
C26  59.35,37.55 270 bottom
C27  58.03,44.67 90 bottom
C28  2.66,42.63 270 bottom
C29  2.66,39.08 90 bottom
C30  43.81,57.11 180 top
C31  49.91,67.02 90 top
C32  49.91,60.41 270 top
C33  49.91,63.72 270 top
C34  37.97,59.91 90 top
C35  2.66,62.45 90 bottom
C36  2.66,58.89 90 bottom
C37  19.93,63.21 90 top
C38  26.54,56.86 180 top
C39  33.4,67.02 90 top
C40  33.4,60.41 270 top
C41  33.4,63.72 270 top
C42  21.97,59.91 90 top
CAN  27.3,4.28 0 top
CAN1  11.81,3.52 180 top
CAN2  17.14,3.52 180 top
COM  36.19,74.13 0 top
D2  66.67,73.62 0 top
ETH  52.7,10.63 0 top
F1  7.49,22.06 90 top
H1  75.56,4.28 0 top
H2  4.44,81.75 0 top
H3  4.44,4.28 0 top
H4  75.56,81.75 0 bottom
IC1  43.81,63.72 90 top
IC2  32.63,43.4 0 top
IC3  73.53,51.27 90 top
IC4  15.87,44.92 270 top
IC5  27.3,18.25 180 bottom
IC8  13.33,63.21 0 top
IC9  27.55,63.72 90 top
ISP  38.73,8.09 270 top
ISP_48  14.35,77.94 90 top
JTAG  17.14,28.41 90 top
KK1  71.24,51.27 90 top
LINK  68.96,3.52 180 top
POWER  54.99,83.27 0 top
Q1  32.89,30.19 180 top
Q2  60.57,25.11 0 top
Q3  5.71,41.11 270 top
Q4  4.95,60.67 90 top
R1  76.83,21.04 270 bottom
R2  24.51,31.46 0 top
R3  24.51,28.92 0 top
R4  37.46,22.57 180 top
R5  37.46,20.28 180 top
R6  37.46,17.74 180 top
R7  54.99,79.21 0 top
R8  18.92,55.08 90 top
R9  14.09,55.08 90 top
R10  46.6,23.84 270 top
R11  49.14,23.84 270 top
R12  44.06,23.84 270 top
R13  51.68,23.84 90 top
R14  16.38,55.08 90 top
R15  12.06,7.07 0 top
R16  69.21,6.82 180 top
R17  64.89,6.82 0 top
R18  17.39,7.07 180 top
R20  20.44,18.25 270 top
RTL  53.97,43.65 270 top
U$2  73.02,20.79 90 top
X2  64.13,81.75 180 top

### Tracks (layer width: path | path; a pad name or v marks a point on that pad's centre or on a via)
A0  (via drill 0.7)
  Top 0.406: RTL.5 47.11,50.48 v48.13,51.27 | IC2.35 36.44,39 v36.44,39.08
  Bottom 0.406: v36.44,39.08 34.92,40.6 34.92,44.92 39.49,49.49 40.76,49.49 41.52,50.25 47.11,50.25 v48.13,51.27
A1  (via drill 0.7)
  Top 0.406: RTL.7 42.29,49.17 v42.03,49.24 | IC2.36 37.25,39.8 v35.94,41.11
  Bottom 0.406: v35.94,41.11 35.94,44.92 39.75,48.73 41.27,48.73 41.78,49.24 v42.03,49.24
A2  (via drill 0.7)
  Top 0.406: RTL.8 47.83,48.52 v48.13,48.22 | IC2.37 37.97,40.6 v37.71,40.86
  Bottom 0.406: v37.71,40.86 36.7,41.87 36.7,44.67 40,47.97 41.52,47.97 41.78,48.22 v48.13,48.22
A3  (via drill 0.7)
  Top 0.406: 38.7,41.4 IC2.38 | v37.71,43.65 37.71,42.38 38.7,41.4 | 38.7,41.4 38.73,41.36 | RTL.9 42.29,47.88 v42.29,47.21
  Bottom 0.406: v37.71,43.65 37.71,44.67 40.25,47.21 v42.29,47.21
A4
  Top 0.406: IC2.39 43.3,42.2 43.3,47.21 44.83,47.21 44.83,47.23 RTL.10
A5  (via drill 0.7)
  Top 0.406: IC2.40 38.98,43 v38.98,42.89 | RTL.29 43.44,34.88 43.05,35.27 v43.05,39.84
  Bottom 0.406: v38.98,42.89 38.98,39.84 v43.05,39.84
A6  (via drill 0.7)
  Top 0.406: IC2.41 42.03,43.8 v42.03,43.4 | RTL.30 43.02,34.23 42.03,35.21 42.03,36.28 42.01,41.08 v42.03,41.11
  Bottom 0.406: v42.03,41.11 v42.03,43.4
A7  (via drill 0.7)
  Top 0.406: IC2.42 38.98,44.6 v38.98,44.41 | RTL.33 49.1,37.76 v49.4,37.81
  Bottom 0.406: v49.4,37.81 44.32,37.81 44.32,44.41 v38.98,44.41
A8  (via drill 0.7)
  Top 0.406: IC2.32 38.63,34.35 42.54,30.44 v42.54,30.19 | R12.2 44.06,23.08 v42.54,23.08
  Bottom 0.406: v42.54,23.08 v42.54,30.19
A9  (via drill 0.7)
  Top 0.406: IC2.31 37.83,34.13 41.02,30.95 v41.02,30.19 | R10.2 46.6,21.55 42.54,21.55 v41.02,23.08
  Bottom 0.406: v41.02,23.08 v41.02,30.19
A10  (via drill 0.7)
  Top 0.406: IC2.9 28.82,43 31.11,40.71 v31.11,37.3 | RTL.4 43.19,51.12 v43.05,51.27
  Bottom 0.406: v43.05,51.27 43.05,51.02 41.27,51.02 40.51,50.25 36.95,50.25 35.43,48.48 34.41,48.48 33.9,47.97 32.89,47.97 32.38,47.46 32.38,46.44 31.87,45.94 31.87,38.06 v31.11,37.3
CAN_INT  (via drill 0.7)
  Top 0.406: IC4.12 v18.66,42.38 | 26.28,44.16 v26.28,44.05 26.28,43.8 IC2.8
  Bottom 0.406: v18.66,42.38 24.25,42.38 v26.28,44.05
CS
  Top 0.406: IC4.16 22.47,47.46 23.49,46.44 23.49,42.2 IC2.10
D0  (via drill 0.7)
  Top 0.406: IC2.51 37.03,51.27 36.95,51.27 36.95,52.03 38.73,53.81 39.49,53.81 v40,54.32 | RTL.36 51.05,34.51 v50.16,34.51
  Bottom 0.406: v40,54.32 40.25,54.57 56.76,54.57 56.76,49.49 54.99,49.49 54.99,34.51 v50.16,34.51
D1  (via drill 0.7)
  Top 0.406: IC2.50 37.83,51.9 38.48,52.54 v39.24,52.54 | RTL.37 51.7,35.52 v51.18,35.52
  Bottom 0.406: v39.24,52.54 39.75,52.54 41.02,53.81 50.16,53.81 52.7,51.52 52.7,48.48 54.22,48.48 54.22,35.52 v51.18,35.52
D2  (via drill 0.7)
  Top 0.406: IC2.49 39.67,51.2 v39.75,51.27 | RTL.38 52.35,36.79 51.18,36.79 v50.92,37.05
  Bottom 0.406: v39.75,51.27 39.75,51.52 41.27,53.05 49.65,53.05 51.94,50.76 51.94,47.71 53.46,47.71 53.46,36.79 51.18,36.79 v50.92,37.05
D3  (via drill 0.7)
  Top 0.406: IC2.48 40.43,49.42 41.78,50.76 v41.78,52.03 | RTL.39 53,37.81 v52.19,37.81
  Bottom 0.406: v41.78,52.03 42.03,52.29 49.14,52.29 51.18,50.25 51.18,46.95 52.7,46.95 52.7,38.32 v52.19,37.81
D4  (via drill 0.7)
  Top 0.406: IC2.47 37.09,48.6 v36.7,48.22 | RTL.40 53.65,30.37 v52.95,29.68
  Bottom 0.406: v36.7,48.22 36.7,47.71 34.16,45.17 34.16,39.59 35.68,38.06 38.98,38.06 44.57,32.47 52.95,32.47 v52.95,29.68
D5  (via drill 0.7)
  Top 0.406: v51.68,28.66 53.46,28.66 54.3,29.5 RTL.41 | IC2.46 39.07,47.8 38.48,47.21 35.17,47.21 v34.92,47.46
  Bottom 0.406: v34.92,47.46 34.92,46.95 33.4,45.43 33.4,39.33 35.43,37.3 38.73,37.3 44.57,31.46 51.68,31.46 v51.68,28.66
D6  (via drill 0.7)
  Top 0.406: v52.7,27.65 53.46,27.65 54.95,29.13 RTL.42 | IC2.45 39.28,47 38.73,46.44 33.9,46.44 v33.4,46.95
  Bottom 0.406: v52.7,27.65 50.67,27.65 50.67,30.44 44.57,30.44 38.48,36.54 35.17,36.54 32.63,39.08 32.63,45.68 33.4,46.44 v33.4,46.95
D7  (via drill 0.7)
  Top 0.406: IC2.44 41.52,46.2 v42.03,45.68 | RTL.43 55.6,33.64 54.73,34.51 54.73,43.9 v50.41,43.9
  Bottom 0.406: v42.03,45.68 42.54,45.17 48.13,45.17 48.13,43.9 v50.41,43.9
GND  (via drill 0.7)
  Top 0.254: 51.68,55.59 51.18,55.59 RTL.95 | RTL.90 54.22,55.59 53.72,55.59 RTL.91 53.72,56.6 53.72,57.87 | 53.65,54.57 52.95,54.57 RTL.92 52.95,55.59 52.45,55.59 RTL.93 52.19,55.59 51.68,55.59 | 51.68,55.59 RTL.94 | RTL.28 45.08,35.52 45.08,36.03 RTL.27 45.08,36.28 | 45.08,37.55 RTL.25 | 45.08,36.79 RTL.26 | 56.26,55.59 55.75,55.59 RTL.88 | 56.26,55.59 56.76,55.59 RTL.86 57.02,56.6 57.02,57.87 | 56.26,55.59 RTL.87 | 62.86,35.52 62.86,35.01 RTL.52 | 45.08,39.33 RTL.22 45.08,39.59 | IC2.59 30.6,51.27 30.09,51.27 IC2.60 29.59,51.27 29.08,51.27 IC2.61 | 51.18,57.87 50.92,57.87 | RTL.56 61.84,37.55 61.34,37.05 v61.08,36.54 61.59,36.28 61.84,36.28 RTL.54 62.86,36.03 62.86,35.52 | RTL.18 45.08,41.87 45.08,41.36 RTL.19 | 45.08,40.09 RTL.21 | 62.86,35.52 RTL.53 | 45.08,38.06 RTL.24 | 45.08,38.82 RTL.23 | ISP.4 40.51,10.63
  Top 0.406: C37.2 19.93,64.22 19.32,63.61 IC8.21 13.95,63.61 13.08,64.48 v10.79,64.48 9.04,64.48 IC8.3 8.83,64.41 8.76,64.48 8.25,64.48 8,64.22 8,62.95 8.14,62.81 IC8.5 | IC9.11 25.9,65.62 28.44,68.16 IC9.8 32.13,68.16 | C39.2 33.23,67.87 33.14,67.78 32.76,68.16 32.13,68.16 | C34.2 37.97,60.92 38.35,60.54 | 40.51,60.41 40.64,60.54 IC1.15 | IC2.53 35.43,53.3 34.92,53.81 34.92,54.06 34.67,54.32 C5.1 | C7.1 30.44,54.23 30.63,54.03 IC2.59 | RTL.91 53.65,54.57 53.65,52.98 v53.46,52.79 | C37.2 19.93,63.97 | COM.6 32.13,75.4 32.13,68.16 | C37.2 20.1,64.06 20.95,63.21 20.95,61.68 21.88,60.76 C42.2 22.13,60.76 22.35,60.54 IC9.15 24.63,60.54 24.76,60.41 26.03,60.41 26.28,60.16 26.28,58.89 25.69,58.04 C38.2 25.52,56.86 | v48.13,46.7 arc-90 48.01,46.57 RTL.11 45.01,46.01 45.08,45.94 45.07,45.92 RTL.12 | v47.87,40.6 47.75,40.73 | v56.51,34.51 56.25,34.51 RTL.44 56.25,31.7 56.26,31.71 56.26,29.43 53.21,26.38 53.21,22.99 | RTL.55 61.08,36.82 v61.08,36.54 | RTL.64 60.07,42.67 v60.07,43.65 | 45.01,45.5 45.08,45.43 45.01,45.35 RTL.13 45.01,44.74 45.08,44.67 45.04,44.62 RTL.14 | CAN.1 22.05,13 IC5.8 | 64.64,18.25 64.64,20.79 C4.2 64.55,19.01 v62.61,19.01 | 64.64,18.25 C3.1 | 64.64,18.25 64.64,15.71 | C14.2 64.64,13.17 64.64,15.71 | 64.64,15.71 C2.1 | 53.21,22.99 R13.1 | 53.21,22.99 54.82,22.99 v55.75,22.06 | 40,10.88 40.25,10.63 40.51,10.63 42.79,10.63 42.79,20.79 51.68,20.79 51.68,22.82 | RTL.83 58.85,57.87 v58.8,57.87 | 30.6,55.59 30.6,54.32 30.6,56.1 | IC2.61 29.08,51.2 29.08,50 27.43,50 IC2.63 | 30.6,35.6 IC2.22 30.63,33.78 29.08,32.22 27.55,32.22 26.79,31.46 v26.79,30.44 | IC4.9 9.27,39.84 v9.27,38.57
  Top 0.406: IC5.2 26.03,26.38 | 26.03,26.38 C6.1 | 26.03,26.38 26.79,26.38 v27.05,26.63
  Top 0.813: 38.35,60.54 IC1.15 | C30.2 42.96,59.74 42.29,60.41 40.51,60.41 | 50.07,68.03 C31.2 | 50.07,68.03 53.72,68.03 C10.- 60.57,61.18 | 60.57,61.18 C11.- | 47.75,40.73 45.08,40.73 | 45.08,40.73 RTL.20 | RTL.12 45.01,45.5 | 21.97,1.49 4.44,1.49 H3.B3,0 | 21.97,1.49 22.05,1.49 CAN.1 15.87,15.71 JTAG.2 | H1.B3,0 75.56,1.49 61.08,1.49 | 21.97,1.49 40,1.49 | 40,1.49 44.32,1.49 | 44.32,1.49 61.08,1.49 | ETH.G1 44.32,6.06 44.32,1.49 | 61.08,1.49 ETH.G2 | 48.64,74.13 COM.G2 49.91,74.13 | 50.07,68.03 50.07,74.13 49.91,74.13 | 54.14,77.43 54.14,74.13 49.91,74.13 | 54.14,77.43 R7.1 | X2.2 61.62,77.43 54.14,77.43 | ISP.4 ISP.6 ISP.8 | ISP.8 ISP.10 | 40,1.49 ISP.8 | v61.08,36.54 59.81,36.54 59.81,39.84 57.78,41.87 57.78,43.65 58.03,43.65 | v60.07,43.65 58.03,43.65 | 60.57,61.18 58.8,59.4 v58.8,57.87 57.02,57.87 53.72,57.87 51.18,57.87 | v51.68,45.43 56,45.43 56,43.65 58.03,43.65 | 50.92,57.87 45.84,57.87 45.84,55.84 42.79,55.84 42.79,56.86 | 34.67,56.1 34.67,54.32 | 34.67,56.1 36.44,56.1 36.44,60.67 37.97,60.67 C34.2 | 30.6,54.32 C7.1 | 30.6,55.59 25.52,55.59 25.52,56.86 | 30.6,56.1 34.67,56.1 | 45.08,36.28 45.08,36.79 45.08,37.55 45.08,38.06 45.08,38.82 45.08,39.33 | 45.08,40.73 45.08,40.09 45.08,39.59 | 45.08,40.73 45.08,41.36
  Bottom 0.254: H4.B3,0 72.77,83.02 71.5,84.29 63.37,84.29 62.35,83.27 X2.2
  Bottom 0.406: 32.89,27.65 C8.1 | 32.89,27.65 C9.1 | C17.1 61.51,22.39 61.34,22.57 61.13,22.36 60.83,22.36 | 60.83,22.36 C18.1 | C24.2 53.46,51.02 v53.46,52.79 | 32.13,75.4 33.4,76.67 35.43,76.67 36.19,75.91 | 36.19,75.91 COM.3 | COM.9 39.04,76.67 36.95,76.67 36.19,75.91 | C16.2 49.75,46.7 49.65,46.7 | 48.04,40.77 v47.87,40.6 | v61.08,36.54 61.08,36.7 C26.2 59.36,33.49 56.51,33.49 v56.51,34.51 C25.1 | v60.07,43.65 60.07,43.82 | IC5.2 26.03,22.31 | 32.13,75.4 COM.6 | 32.13,84.54 32.13,75.4 | 1.65,35.27 1.39,35.01 1.39,40.86 2.66,40.86 C29.2 C28.2 | C36.2 C35.1 2.66,60.67 1.39,60.67 1.39,67.02 9.27,67.02 | 9.27,64.48 v10.79,64.48 | 49.75,40.86 C15.1 | v55.75,22.06 56.76,21.04 60.83,21.04 | 60.83,21.04 60.83,22.36 | v62.61,19.01 60.83,20.79 60.83,21.04 | JTAG.10 12.57,33.49 12.57,23.33 JTAG.2 | v27.05,26.63 29.84,26.63 | 29.84,26.63 32.89,26.63 32.89,27.65 | v26.79,30.44 26.79,29.68 29.84,26.63
  Bottom 0.813: v48.13,46.7 49.65,46.7 49.65,45.43 v51.68,45.43 51.68,40.86 49.75,40.86 | C15.1 48.04,40.77 | 60.07,43.82 C27.1 | IC3.GND 67.94,51.27 C13.2 C12.2 67.94,50 66.42,50 66.42,43.65 66.16,43.65 | H3.B3,0 1.65,4.28 1.65,35.27 9.27,35.27 v9.27,38.57 9.27,64.48 9.27,67.02 9.27,81.75 | 23.67,84.54 13.08,84.54 ISP_48.10 | 23.67,84.54 COM.G1 | COM.G2 48.64,74.13 48.64,84.54 32.13,84.54 23.67,84.54 | 9.27,81.75 H2.B3,0 | ISP_48.10 9.27,83.02 9.27,81.75 | ISP_48.10 ISP_48.8 ISP_48.6 ISP_48.4 | ETH.G1 44.32,6.06 | 66.16,43.65 v60.07,43.65 | 66.16,43.65 76.07,43.65 76.07,32.47 73.53,32.47 73.53,4.53 75.56,4.53 H1.B3,0 | v58.8,57.87 63.37,57.87 66.42,54.83 66.42,50.25 | IC5.2 26.03,20.03 15.87,20.03 JTAG.2
  other vias: 43.05,62.19 39.49,57.62 14.35,71.34 10.54,52.79 46.6,19.52 65.4,44.67 58.8,48.98 50.67,38.82 43.05,71.34 19.68,21.04
  pour Bottom: 0.12,86.07 79.88,86.07 79.88,-0.04 0.12,-0.04
  pour Top: 0.12,86.07 79.88,86.07 79.88,-0.04 0.12,-0.04
MISO  (via drill 0.7)
  Top 0.406: IC4.15 22.22,46.19 22.73,45.68 v22.73,39.84 22.73,39.8 IC2.13 | v32.38,17.74 R6.2
  Bottom 0.406: v32.38,17.74 32.38,24.09 31.87,24.6 20.19,24.6 19.68,25.11 19.68,26.89 22.73,29.93 22.73,33.24 17.9,38.06 17.9,39.84 v22.73,39.84
MISO_48
  Top 0.406: R14.2 16.38,56.1 16.13,56.1 IC8.16
MOSI  (via drill 0.7)
  Top 0.406: IC4.14 v18.66,44.92 17.65,44.92 14.85,42.13 v13.33,42.13 | IC2.12 26.79,40.6 v27.81,41.36 | R5.2 34.92,20.28 34.92,19.01 v27.05,19.01
  Bottom 0.406: v27.81,41.36 28.06,41.62 28.06,44.92 27.05,45.94 24.51,45.94 23.49,44.92 v18.66,44.92 | v27.05,19.01 15.62,19.01 11.55,23.08 11.81,23.33 11.81,34.51 13.58,34.51 14.85,35.78 13.33,37.3 v13.33,42.13
MOSI_48
  Top 0.406: IC8.15 15.33,57.62 14.09,57.62 R9.2
N$1
  Top 0.305: RTL.58 64.18,38.77 64.64,38.32 64.64,33.24 65.4,32.47 75.56,32.47 76.83,31.2 U$2.6
  Bottom 0.406: R1.2 74.8,20.19 74.8,29.68 U$2.6 77.08,29.68
N$2  (via drill 0.7)
  Top 0.406: v14.09,46.19 14.09,50 IC4.1
  Bottom 0.406: IC5.1 17.14,22.06 17.14,23.84 16.38,24.6 13.84,24.6 13.84,32.22 16.38,32.22 17.14,32.98 17.14,35.52 15.87,36.79 15.36,36.79 14.35,37.81 14.35,43.4 14.09,43.65 v14.09,46.19
N$3
  Top 0.305: RTL.59 64.29,39.42 65.15,38.57 65.15,33.49 65.65,32.98 77.34,32.98 78.61,31.71 78.61,25.62 77.59,24.6 U$2.4
  Bottom 0.406: U$2.4 R1.1
N$4  (via drill 0.7)
  Top 0.406: U$2.3 78.61,15.2 78.61,11.14 77.34,9.87 68.96,9.87 68.45,9.36 65.4,9.36 64.55,10.21 C1.1 61.84,10.63 61.84,13.68 v54.48,13.68 | RTL.46 57.55,29.68 v58.8,29.68
  Bottom 0.406: v58.8,29.68 56.26,29.68 53.21,26.63 53.21,19.01 54.48,17.74 v54.48,13.68
N$5
  Top 0.406: C7.2 28.74,54.23 28.23,53.73 IC2.62
N$6
  Top 0.406: Q1.1 35.43,30.19 32.23,33.38 IC2.24
  Bottom 0.406: Q1.1 35.43,30.19 35.52,30.1 C9.2
N$7
  Top 0.406: Q1.2 30.6,30.19 31.43,31.02 IC2.23
  Bottom 0.406: Q1.2 30.47,30.06 30.6,29.93 30.51,29.85 C8.2
N$8
  Top 0.813: D2.C 56.76,71.34 C10.+
  Bottom 0.813: C12.1 68.03,48.39 68.19,48.22 68.7,48.73 IC3.IN 78.35,48.73 78.35,56.35 68.96,56.35 C10.+
N$9
  Top 0.406: IC1.7 47.01,67.02 48.38,67.02 48.38,69.05 45.59,69.05 45.33,69.3 45.33,72.1 39.75,77.69 32.63,77.69 30.6,75.65 30.6,73.11 30.86,72.86 COM.1
N$10
  Top 0.813: X2.1 66.64,81.27 D2.A
N$11  (via drill 0.7)
  Top 0.406: C1.2 v67.69,10.63 75.56,10.63 U$2.1 | RTL.45 56.9,28.66 v57.53,28.66
  Bottom 0.406: v57.53,28.66 56.26,28.66 53.97,26.38 53.97,22.06 55.75,20.28 55.75,19.01 57.27,17.49 57.27,14.44 61.84,14.44 61.84,10.63 v67.69,10.63
N$12
  Top 0.406: C3.2 72.77,18.25 74.04,19.52 74.04,25.62 75.31,26.89 76.58,26.89 U$2.5
N$13
  Top 0.406: C2.2 75.56,15.71 U$2.2
N$14
  Top 0.406: U$2.11 69.21,14.19 68.19,13.17 C14.1
N$15
  Top 0.406: C4.1 69.72,20.79 71.24,22.31 71.24,26.12 70.23,27.14 U$2.8
N$16
  Bottom 0.813: F1.1 17.22,10.81 21.46,6.57 32.63,6.57 32.63,9.53 | 32.63,9.53 32.63,9.61 | 32.63,9.53 CAN.4
N$17  (via drill 0.7)
  Top 0.406: v17.39,52.29 16.38,53.3 R14.1
  Bottom 0.406: v17.39,52.29 17.9,52.79 17.9,79.21 14.35,79.21 14.35,81.75 ISP_48.9
N$18
  Top 0.406: U$2.12 62.61,11.9 62.61,14.95 48.13,14.95 48.13,16.98 ETH.1-1
N$19  (via drill 0.7)
  Top 0.406: v62.61,16.98 62.61,15.71 49.65,15.71 49.65,19.52 ETH.1-2
  Bottom 0.406: v62.61,16.98 U$2.10
N$20
  Top 0.406: U$2.9 66.67,22.06 63.88,22.06 60.07,18.25 51.94,18.25 50.67,16.98 ETH.1-3
N$21  (via drill 0.7)
  Top 0.406: v15.11,44.16 13.08,44.16 13.08,48.73 IC4.2
  Bottom 0.406: IC5.4 31.11,23.84 19.68,23.84 18.92,24.6 17.65,24.6 17.14,25.11 17.14,31.46 17.9,32.22 19.17,32.22 19.93,32.98 19.93,34 16.38,37.55 15.62,37.55 15.11,38.06 v15.11,44.16
N$22
  Top 0.406: R6.1 40,17.74 40,15.96 35.68,15.96 35.68,3.01 ISP.9
N$23
  Top 0.406: CAN.3 29.05,13.96 IC5.6 28.57,16.98 21.97,16.98 21.97,19.27 20.44,19.27 R20.1
N$24
  Top 0.406: U$2.7 67.18,27.65 67.18,23.58 66.42,22.82 63.62,22.82 61.34,20.79 56,20.79 54.73,19.52 ETH.1-6
N$25
  Top 0.406: ISP.1 37.46,14.69 40.76,14.69 40.76,19.01 39.49,20.28 R5.1
N$26  (via drill 0.7)
  Top 0.406: v21.71,30.44 21.71,28.92 R3.1 | IC2.1 25.62,49.4 26.54,48.48 v26.54,47.21
  Bottom 0.406: v26.54,47.21 16.89,47.21 16.89,39.59 17.14,39.33 17.14,37.81 21.71,33.24 v21.71,30.44
N$27
  Top 0.406: IC4.11 15.62,41.11 11.04,36.54 11.04,9.87 9.27,8.09 9.27,4.53 10.54,3.26 CAN1.K
N$28
  Top 0.406: R16.1 70.23,6.82 LINK.A
N$29
  Top 0.406: ISP.7 38.73,6.82 38.73,11.9 41.78,11.9 41.78,20.28 39.49,22.57 R4.1 38.22,22.57
N$30  (via drill 0.7)
  Top 0.406: v15.87,52.29 14.09,52.29 R9.1
  Bottom 0.406: v15.87,52.29 17.14,53.56 17.14,72.86 ISP_48.1 15.36,72.86
N$31
  Top 0.406: R7.2 55.84,79.46 56.26,79.46 POWER.K
N$32  (via drill 0.7)
  Top 0.406: IC2.58 31.43,54.83 v31.87,54.83
  Bottom 0.406: v31.87,54.83 27.81,54.83 25.52,52.54 20.19,52.54 19.68,53.05 19.68,70.07 53.72,70.07 POWER.A
N$33
  Top 0.406: COM.2 33.45,76.21 33.9,76.67 35.43,76.67 36.19,75.91 36.19,74.89 37.46,73.62 37.46,72.1 35.94,70.57 35.94,63.72 36.7,62.95 40.51,62.95 40.74,63.18 | 40.74,63.18 40.76,63.21 | 40.74,63.18 IC1.13
N$34
  Top 0.406: 63.19,25.18 62.99,24.98 Q2.2 62.86,25.11 61.08,28.41 61.08,32.98 62.33,34.23 RTL.51
  Bottom 0.406: Q2.2 62.99,24.98 63.25,24.71 C17.2
N$35
  Top 0.406: Q2.1 58.29,25.11 60.15,28.49 RTL.50
  Bottom 0.406: Q2.1 58.16,24.98 58.03,24.85 58.23,24.66 C18.2
N$36  (via drill 0.61, 0.7)
  Top 0.254: 46.1,25.11 R10.1
  Top 0.406: R10.1 46.6,24.6 47.87,24.6 47.87,23.08 49.14,23.08 R11.2 | v62.1,30.95 v74.8,30.95 | v46.86,33.49 43.81,30.44 v43.81,29.43 | 46.1,25.11 v46.1,27.14 | RTL.77 64.78,51.12 66.67,49.24 66.67,46.7 v68.19,45.17
  Bottom 0.406: v74.8,30.95 77.08,30.95 77.08,44.16 76.07,45.17 v68.19,45.17 | v62.1,30.95 60.07,32.73 54.22,32.73 53.46,33.49 v46.86,33.49 | v46.1,27.14 v43.81,29.43
N$37  (via drill 0.61, 0.7)
  Top 0.254: 44.57,25.11 R12.1
  Top 0.406: v44.57,26.63 44.57,25.11 | v67.94,8.34 68.7,8.34 69.46,9.11 v78.35,9.11 | RTL.79 65.01,52.42 v69.97,47.46
  Bottom 0.406: v44.57,26.63 44.57,14.69 50.16,14.69 57.27,7.58 60.07,7.58 60.83,8.34 v67.94,8.34 | v69.97,47.46 78.61,47.46 78.61,9.36 v78.35,9.11
N$38  (via drill 0.7)
  Top 0.406: 21.2,39.84 IC4.10 15.36,39.84 11.81,36.28 11.81,8.6 v14.6,8.6
  Bottom 0.406: CAN2.K 14.6,4.79 v14.6,8.6
N$39
  Top 0.406: 51.68,24.6 R13.2 51.68,25.87 49.75,27.81 RTL.34
N$40  (via drill 0.7)
  Top 0.406: v18.92,52.29 R8.1
  Bottom 0.406: v18.92,52.29 18.92,80.48 ISP_48.7
N$44
  Top 0.406: R17.1 63.88,6.82 63.88,5.3 ACT.A
N$45  (via drill 0.7)
  Top 0.406: RTL.61 60.71,40.73 v59.05,42.38
  Bottom 0.406: LINK.K 67.69,5.3 72.26,9.87 72.26,31.71 68.7,35.27 68.7,42.38 v59.05,42.38
N$47  (via drill 0.7)
  Top 0.406: RTL.62 64.88,41.38 v64.89,41.36
  Bottom 0.406: v64.89,41.36 67.94,41.36 67.94,35.01 71.5,31.46 71.5,10.38 66.42,5.3 64.89,5.3 ACT.K
N$48
  Top 0.406: R15.1 11.21,5.38 CAN1.A
N$52
  Top 0.406: R18.1 18.24,6.91 18.16,6.82 18.41,6.57 CAN2.A
N$53
  Top 0.406: Q3.1 5.71,43.4 6.73,42.38 IC4.7
  Bottom 0.406: C28.1 2.83,43.48 2.92,43.4 3.04,43.52 Q3.1
N$54
  Top 0.406: Q3.2 5.71,38.57 8.25,41.11 IC4.8
  Bottom 0.406: Q3.2 3.8,38.7 3.17,38.06 2.66,38.06 C29.1
N$59
  Top 0.406: CAN.2 25.55,13.96 IC5.7 26.03,16.22 20.44,16.22 R20.2
N$60
  Top 0.406: C32.2 49.91,59.4 49.78,59.27 IC1.1
N$61
  Top 0.406: C33.2 49.91,62.7 49.53,63.08 IC1.4
N$68  (via drill 0.7)
  Top 0.406: IC2.54 34.67,51.23 34.67,52.54 33.14,54.06 v33.4,54.57 | JTAG.9 19.43,33.49 v22.47,36.54
  Bottom 0.406: v33.4,54.57 33.14,53.81 28.57,53.81 28.57,49.24 28.82,48.98 28.82,39.59 26.03,36.79 22.73,36.79 v22.47,36.54
N$69  (via drill 0.7)
  Top 0.406: IC2.55 33.83,52.03 33.07,52.79 v32.63,52.79 | JTAG.3 21.46,25.87 v21.97,26.38
  Bottom 0.406: v32.63,52.79 32.63,48.73 31.62,47.71 31.62,46.7 31.11,46.19 31.11,38.82 25.01,32.73 25.01,26.38 v21.97,26.38
N$70  (via drill 0.7)
  Top 0.406: IC2.56 33.03,50.15 32.13,49.24 31.62,49.24 v31.36,48.98 | JTAG.5 18.41,29.17 19.93,30.7 19.93,31.71 22.47,34.25 24,34.25 v24.76,35.01
  Bottom 0.406: v31.36,48.98 30.86,48.48 30.86,47.46 30.35,46.95 30.35,39.08 26.28,35.01 v24.76,35.01
N$71  (via drill 0.7)
  Top 0.406: v29.84,49.24 29.84,50 31.87,50 32.23,50.36 IC2.57 | JTAG.1 18.41,18 v17.9,18 | v13.08,35.78 13.58,35.27 13.58,32.22 19.17,32.22 22.47,35.52 v23.49,35.52
  Bottom 0.406: v29.84,49.24 29.84,48.22 29.59,47.97 29.59,39.33 26.28,36.03 23.74,36.03 v23.49,35.52 | v17.9,18 9.01,18 9.01,29.68 11.04,31.71 11.04,36.03 12.82,36.03 v13.08,35.78
N$72
  Top 0.406: C33.1 49.91,64.73 49.53,64.35 IC1.5
N$73
  Top 0.406: C32.1 49.91,61.43 49.53,61.81 IC1.3
N$74
  Top 0.406: COM.7 34.92,75.4 34.92,62.45 35.55,61.81 IC1.14
N$75
  Top 0.406: COM.8 37.97,75.4 39.24,74.13 42.29,74.13 44.57,71.84 44.57,69.05 45.33,68.29 46.6,68.29 46.86,68.03 46.88,68.06 IC1.8
N$76
  Top 0.406: C30.1 44.66,59.74 45.33,60.41 47.37,60.41 47.24,60.54 IC1.2
N$77
  Top 0.406: C31.1 49.91,66 49.53,65.62 IC1.6
N$78  (via drill 0.7)
  Top 0.406: COM.4 38.93,72.05 36.95,70.07 v36.95,67.02 | IC9.7 28.95,66.89 v28.82,67.02
  Bottom 0.406: v28.82,67.02 v36.95,67.02
N$79
  Top 0.406: Q4.2 4.95,62.95 6.69,61.21 IC8.7
  Bottom 0.406: Q4.2 4.95,62.95 4.61,63.3 C35.2
N$80
  Top 0.406: Q4.1 4.95,58.13 7.23,60.41 IC8.8
  Bottom 0.406: Q4.1 4.95,58.13 4.86,58.04 C36.1
N$82  (via drill 0.7)
  Top 0.406: IC9.13 25.39,63.08 v28.06,65.75 | v37.97,65.75 37.97,69.81 41.02,72.86 COM.5
  Bottom 0.406: v28.06,65.75 v37.97,65.75
N$83
  Top 0.406: C40.2 33.4,59.4 33.27,59.27 IC9.1
N$84
  Top 0.406: C41.2 33.4,62.45 32.76,63.08 IC9.4
N$85
  Top 0.406: C41.1 33.31,64.57 33.14,64.73 32.76,64.35 IC9.5
N$86
  Top 0.406: C40.1 33.31,61.26 32.76,61.81 IC9.3
N$87
  Top 0.406: IC8.30 12.13,69.05 21.97,69.05 21.97,64.48 24.48,64.48 IC9.12
N$88
  Top 0.406: IC9.10 22.73,66.89 22.73,69.81 11.3,69.81 11.3,67.5 IC8.31
N$89
  Top 0.406: IC9.2 28.44,60.54 27.55,59.65 27.55,57.11 27.3,56.86 C38.1
N$90
  Top 0.406: C39.1 33.4,66 33.02,65.62 IC9.6
RST  (via drill 0.7)
  Top 0.406: IC2.20 29.03,34.46 28.57,34 25.78,34 | v34.16,14.44 34.16,16.22 29.33,16.22 29.33,17.74 24.76,17.74 24.76,24.6 23.49,24.6 23.49,26.38 C6.2 23.24,26.38 23.24,27.39 22.98,27.65 19.93,27.65 19.68,27.9 | JTAG.6 17.14,27.14 18.92,27.14 19.68,27.9 | IC8.29 12.93,65.75 v11.81,65.75 10.79,65.75 9.77,66.76 9.77,74.89 11.55,76.67 14.35,76.67 ISP_48.5 | v16.12,48.73 IC4.17 | v16.12,38.57 23.49,38.57 23.49,36.54 25.78,36.54 25.78,34 | 19.68,27.9 19.68,29.43 20.7,30.44 20.7,31.46 R2.1 23.66,31.62 23.49,31.71 25.78,34
  Bottom 0.406: v34.16,14.44 34.16,8.09 ISP.5 | v11.81,65.75 11.81,48.73 v16.12,48.73 v16.12,38.57
RXD  (via drill 0.7)
  Top 0.406: IC2.2 23.88,48.6 23.24,49.24 v23.24,57.87 | IC1.12 43.05,64.35 v43.05,64.22
  Bottom 0.406: v43.05,64.22 40.25,64.22 38.98,62.95 23.24,62.95 v23.24,57.87
RXD1  (via drill 0.7)
  Top 0.406: IC2.27 34.63,39.62 34.16,40.09 34.16,42.89 31.11,45.94 31.11,47.21 33.14,49.24 33.65,49.24 v34.16,49.75 | IC1.9 43.43,68.16 arc-90 v43.56,68.03
  Bottom 0.406: v34.16,49.75 34.16,53.3 34.67,53.81 34.67,55.08 33.9,55.84 25.27,55.84 25.01,55.59 21.46,55.59 20.7,56.35 20.7,69.3 43.56,69.3 v43.56,68.03
SCK  (via drill 0.7)
  Top 0.406: v18.16,43.65 IC4.13 | IC2.11 26.03,41.4 v26.54,41.9 | v34.16,22.57 R4.2
  Bottom 0.406: v18.16,43.65 23.74,43.65 25.78,45.17 26.79,45.17 27.3,44.67 27.3,43.14 26.54,42.38 v26.54,41.9 26.54,41.87 22.73,38.06 22.22,38.06 20.95,36.79 20.95,36.03 23.49,33.49 23.49,29.68 20.44,26.63 20.44,25.62 20.7,25.36 32.13,25.36 33.14,24.35 33.14,23.58 v34.16,22.57
SCK_48
  Top 0.254: 18.16,60.41 IC8.17 | 18.92,60.41
  Top 0.406: R8.2 18.92,60.41 | 18.92,60.41 18.16,60.41
SCL  (via drill 0.7)
  Top 0.406: IC8.28 13.73,65.35 v14.09,64.99 | IC2.25 33.03,36.65 32.38,37.3 32.38,40.6 29.08,43.9 27.81,43.9 v27.81,48.22
  Bottom 0.406: v14.09,64.99 14.09,59.65 13.58,59.14 13.58,50.51 24.51,50.51 26.79,48.22 v27.81,48.22
SDA  (via drill 0.7)
  Top 0.406: v24.76,51.52 26.79,49.24 28.32,49.24 29.08,48.22 29.08,44.92 33.14,40.86 33.14,37.55 33.83,36.86 IC2.26 | IC8.27 14.53,66.58 v15.11,66
  Bottom 0.406: v24.76,51.52 24.51,51.52 24.25,51.27 14.6,51.27 14.6,59.14 15.11,59.65 v15.11,66
TXD  (via drill 0.7)
  Top 0.406: IC2.3 23.15,47.8 22.47,48.48 22.47,51.27 21.97,51.27 v21.97,56.86 | IC1.10 39.62,66.89 39.24,66.51 39.24,65.24 v38.22,64.22
  Bottom 0.406: v38.22,64.22 21.97,64.22 v21.97,56.86
TXD1  (via drill 0.7)
  Top 0.406: IC2.28 35.43,40.09 34.92,40.6 34.92,43.4 32.38,45.94 32.38,47.46 32.89,47.97 33.9,47.97 34.41,48.48 35.43,48.48 36.7,50 39.49,50 39.75,50.25 40.25,50.25 40.76,50.76 40.76,53.3 41.02,53.56 v41.02,57.37 | IC1.11 44.32,65.62 v44.32,65.49
  Bottom 0.406: v41.02,57.37 44.32,60.67 v44.32,65.49
VCC  (via drill 0.7)
  Top 0.254: RTL.65 61.84,43.4 61.34,43.4 61.34,46.57 | 48.13,32.73 47.87,32.73 RTL.31 | RTL.32 48.38,31.71 48.13,31.71
  Top 0.406: 10.03,62.01 IC8.6 | 10.28,62.01 10.03,62.01 | 13.08,62.01 10.28,62.01 | 13.08,62.01 13.26,62.01 14.06,61.21 IC8.18 18.38,61.21 18.41,61.18 19.59,62.36 C37.1 | 37.97,58.89 38.22,58.64 38.86,59.27 IC1.16 | 25.52,31.46 27.05,32.98 28.82,32.98 29.83,33.99 IC2.21 29.84,35.52 | IC2.52 36.23,53.6 36.7,54.06 36.53,54.23 C5.2 37.97,55.75 v37.97,55.84 37.97,58.89 | IC8.4 9.88,63.61 10.28,63.21 10.28,62.19 10.03,61.94 10.03,62.01 | RTL.89 54.95,52.84 v54.99,52.79 54.99,51.52 | C37.1 19.93,62.45 | C37.1 19.93,60.92 21.71,59.14 21.71,58.89 21.88,59.06 C42.1 22.05,59.06 22.22,58.89 22.6,59.27 IC9.16 24.48,59.4 | RTL.6 48.05,49.82 v48.13,49.75 49.4,49.75 49.4,51.52 | RTL.47 58.2,34.51 v58.03,34.51 | RTL.57 61.08,38.12 v61.08,38.32 | RTL.70 61.34,46.57 60.07,46.57 60.07,46.95 | 60.07,46.95 v60.07,45.68 | 45.08,43.25 45.08,43.14 | RTL.15 45.08,43.9 45.08,43.25 | 45.08,43.25 RTL.16 | 45.08,43.25 45.08,42.75 RTL.17 45.01,42.63 v47.87,42.63 49.14,42.63 | R18.2 16.63,7.07 | R15.2 R18.2 | R18.2 16.54,8.69 15.36,9.87 13.33,9.87 v13.33,16.47 13.33,25.87 | 13.33,25.87 JTAG.4 | 13.08,62.01 v13.08,61.94 | 37.97,58.89 C34.1 | 49.4,46.95 60.07,46.95 | R11.1 49.14,26.12 48.38,26.89 48.38,31.71 48.41,31.68 RTL.32 | R17.2 65.65,6.82 | R17.2 R16.2 | R17.2 66.92,6.82 66.92,8.34 60.83,8.34 60.07,7.58 56,7.58 49.91,13.68 v45.08,13.68 | 25.52,31.46 R2.2 | 25.52,28.92 25.52,31.46 | 25.52,28.41 25.52,28.75 R3.2 25.52,28.92 | IC2.64 26.63,51.52 26.54,51.52 26.54,54.32 24.25,54.32 v24.25,56.86 24.23,55.84 24.23,59.4 24.48,59.4 | 24.48,59.4 24.51,59.4 | 9.27,46.19 IC4.4 | 9.27,51.27 9.27,59.14 10.28,60.16 10.28,62.01 | 9.27,51.27 9.27,46.19
  Top 0.406: IC4.18 19.68,50 18.41,51.27 9.27,51.27 | IC4.6 9.27,43.65 9.27,44.92 | 9.27,46.19 9.27,44.92 | 9.27,44.92 IC4.5 | JTAG.7 17.14,29.68 13.33,29.68 13.33,25.87 | 28.57,25.36 28.57,26.89 26.54,28.92 25.52,28.92
  Top 0.813: C11.+ 61.59,54.32 58.8,51.52 54.99,51.52 49.4,51.52 49.4,46.95 49.4,45.68 49.14,45.68 49.14,42.63 49.14,39.33 48.13,39.33 48.13,32.73 48.13,31.71 | RTL.31 41.47,25.36 28.57,25.36 IC5.3
  Bottom 0.254: C25.2 56.76,38.82 56.76,45.17 57.78,45.17 C27.2
  Bottom 0.406: v54.99,52.79 55.49,52.29 55.49,51.27 55.33,51.1 C24.1 | C16.1 49.75,49.75 v48.13,49.75 | C15.2 49.59,42.63 v47.87,42.63 | v61.08,38.32 61.08,38.4 C26.1 59.36,38.57 58.03,38.57 | C27.2 60.07,45.52 v60.07,45.68 | IC5.3 28.57,16.22 40,16.22 40,13.68 | v13.08,61.94 ISP_48.2 | 40,13.68 ISP.2 | 40,13.68 v45.08,13.68 | 58.03,38.57 v58.03,34.51 | C25.2 56.51,38.57 58.03,38.57
  Bottom 0.813: 67.94,53.81 67.69,53.81 | 67.94,53.81 68.19,53.81 | 67.94,53.81 IC3.OUT | 67.94,53.81 C13.1 | 67.94,53.81 67.94,55.59 64.38,59.14 C11.+ 58.03,59.14 55.49,55.84 v37.97,55.84 37.97,56.86 v24.25,56.86 | F1.2 7.49,16.47 v13.33,16.47 28.57,16.47 IC5.3